# EAGLE schematic Full_Schematic (EAGLE 9.6.2)
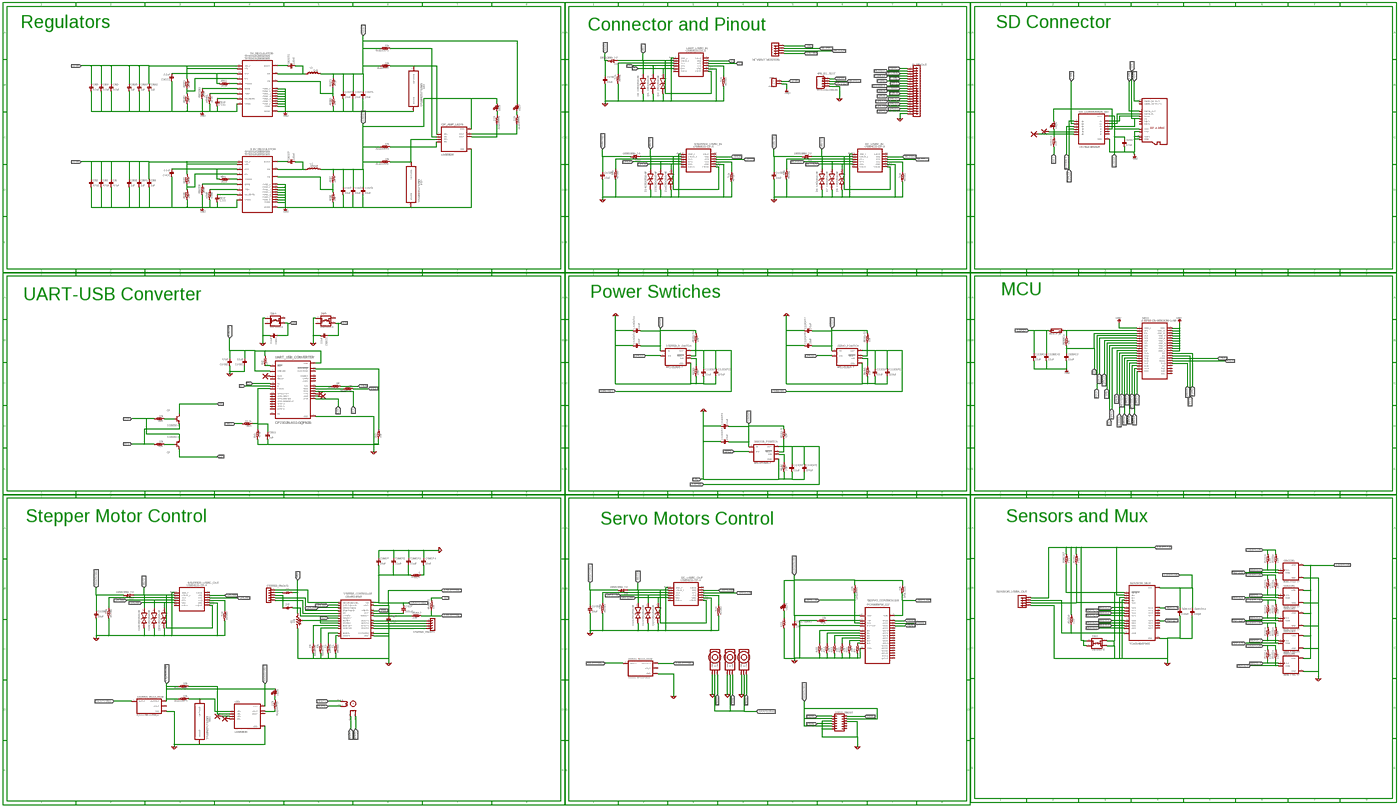
[diagram p0: schematic, sheet 1, overview]
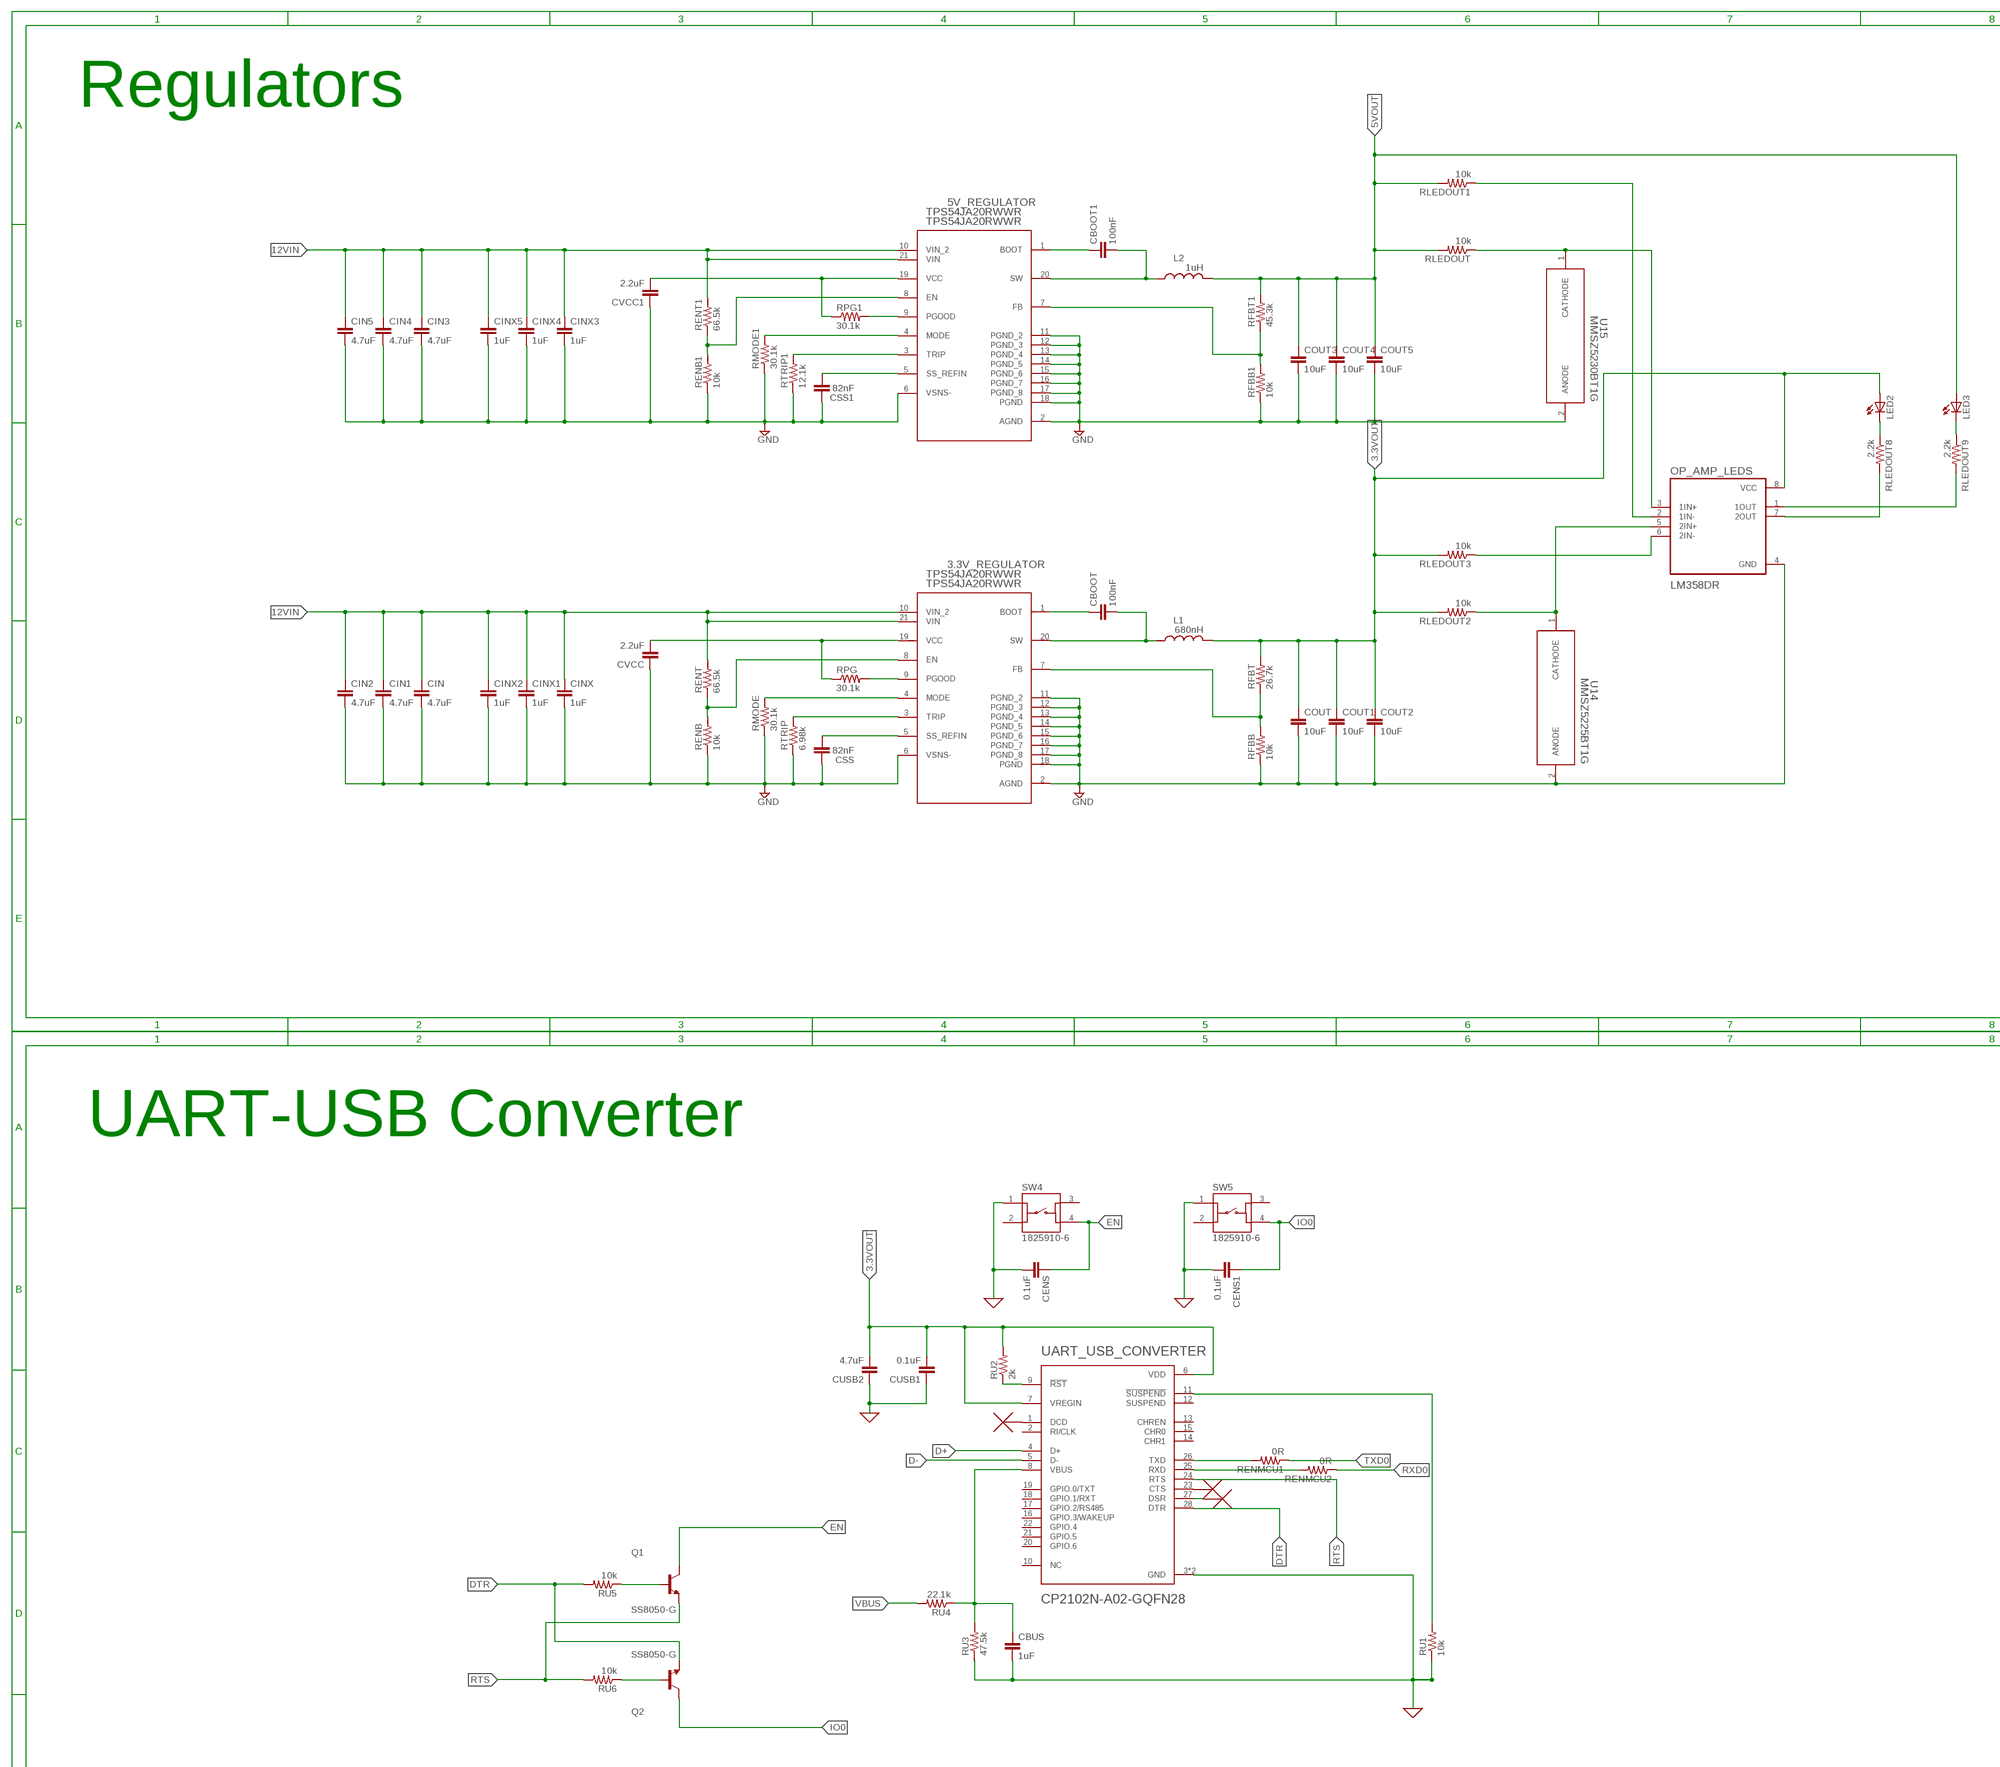
[diagram p1: schematic, sheet 1, part 1 of 8]
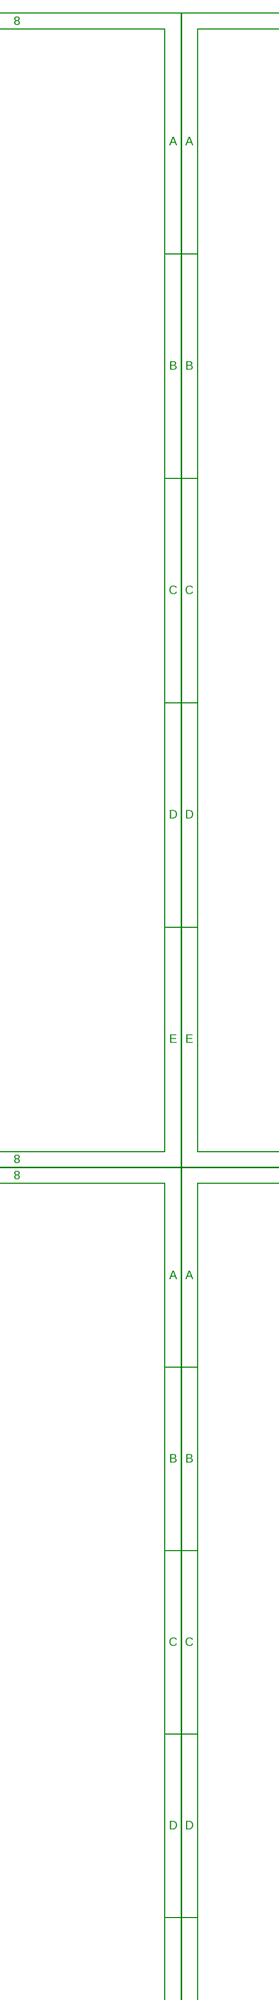
[diagram p2: schematic, sheet 1, part 2 of 8]
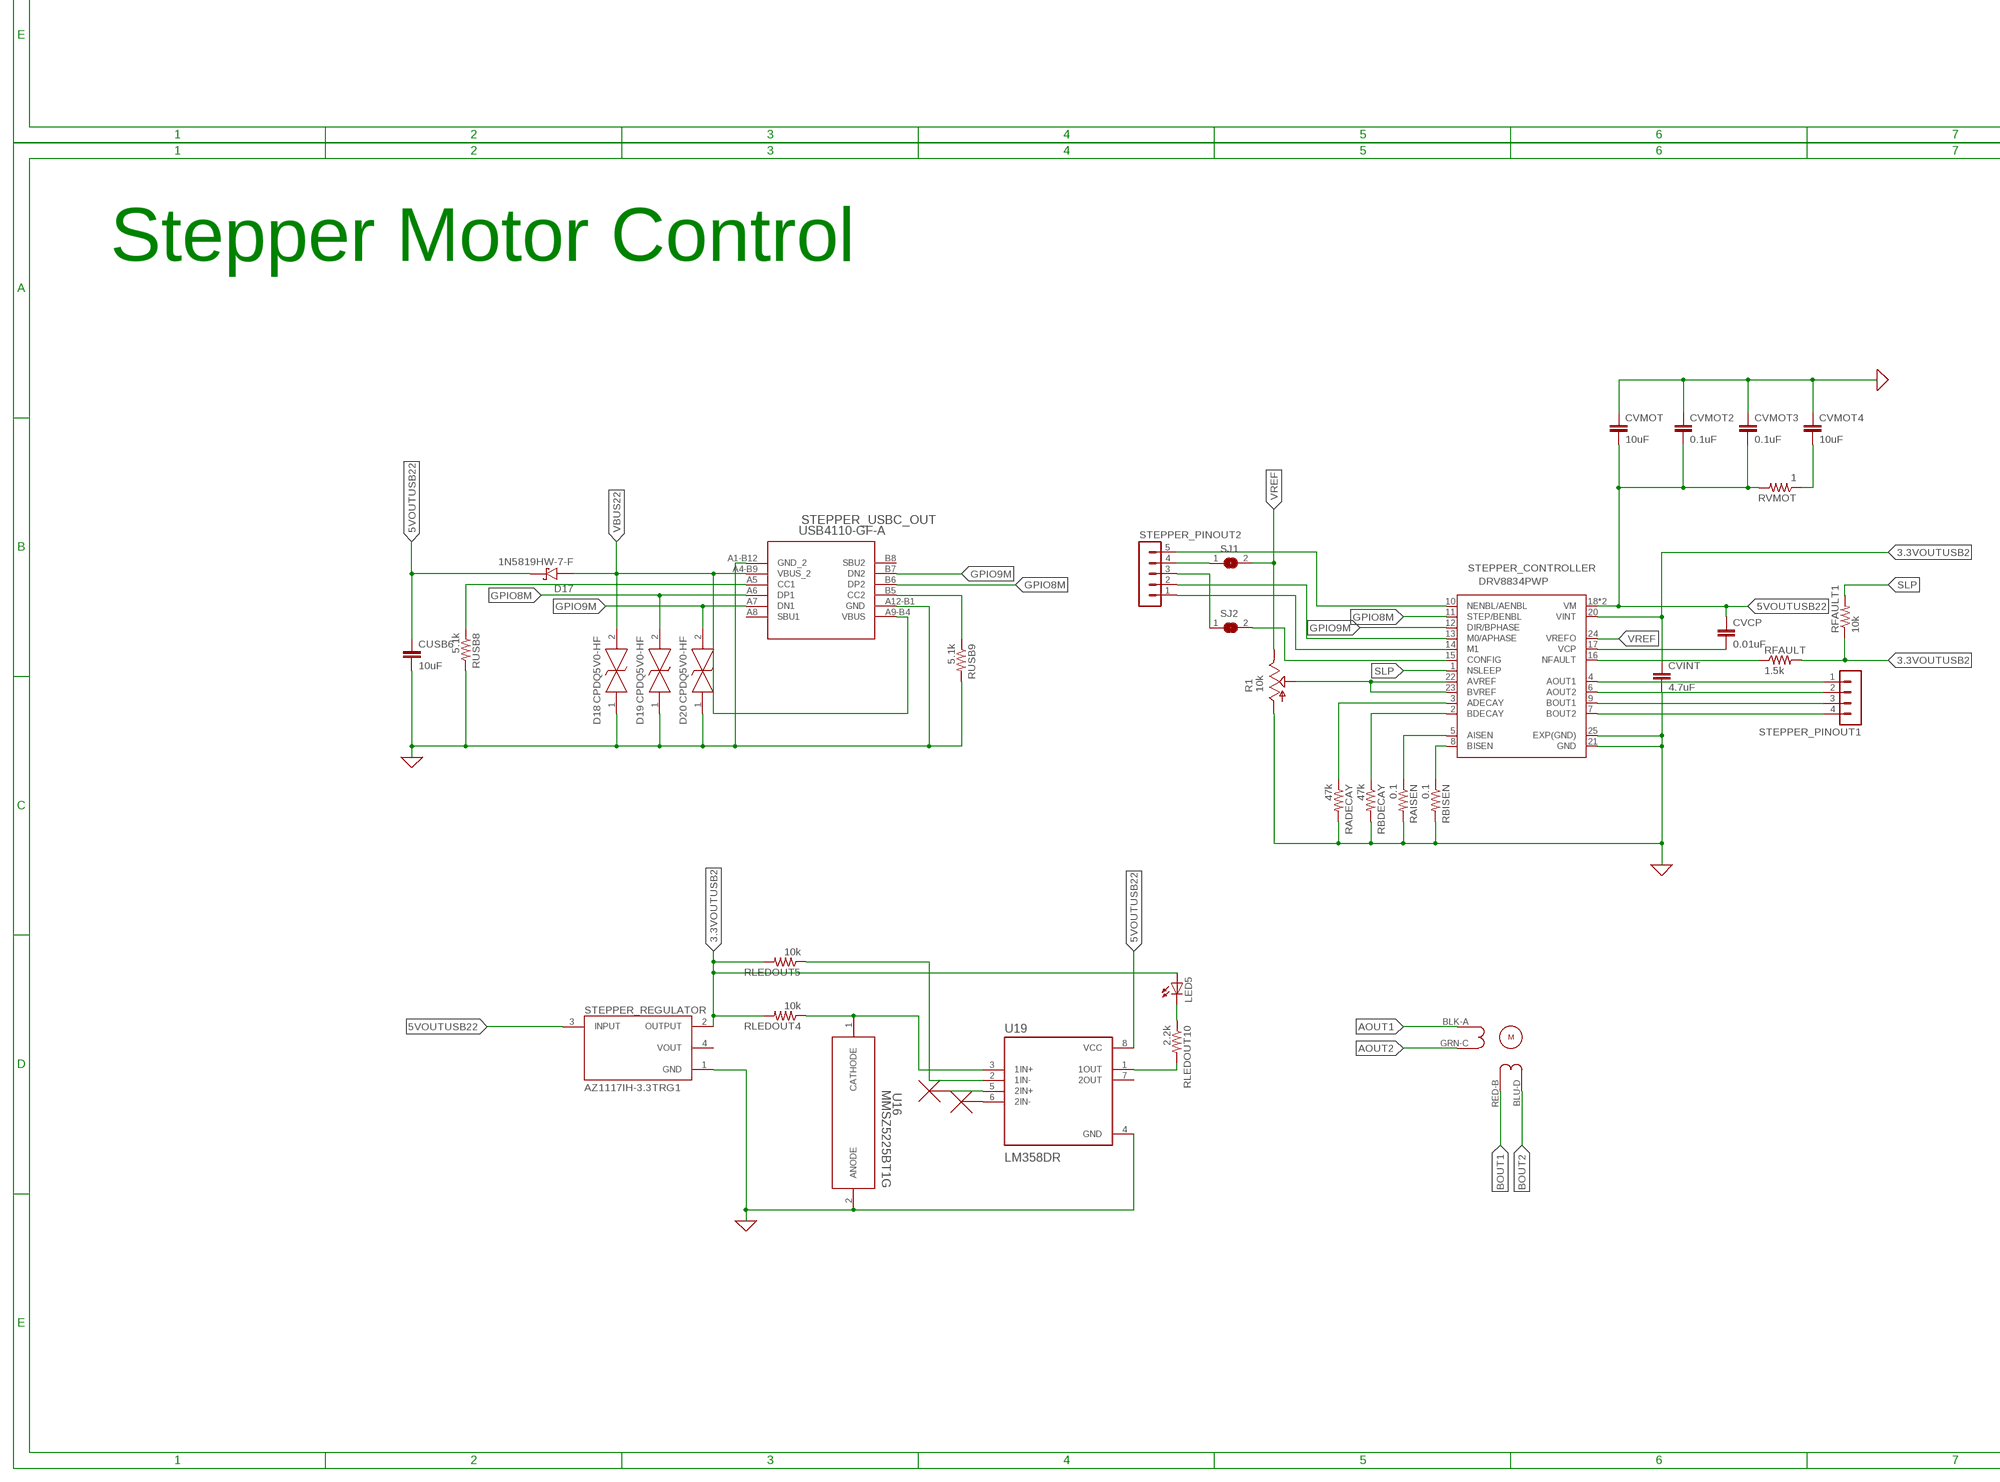
[diagram p3: schematic, sheet 1, part 3 of 8]
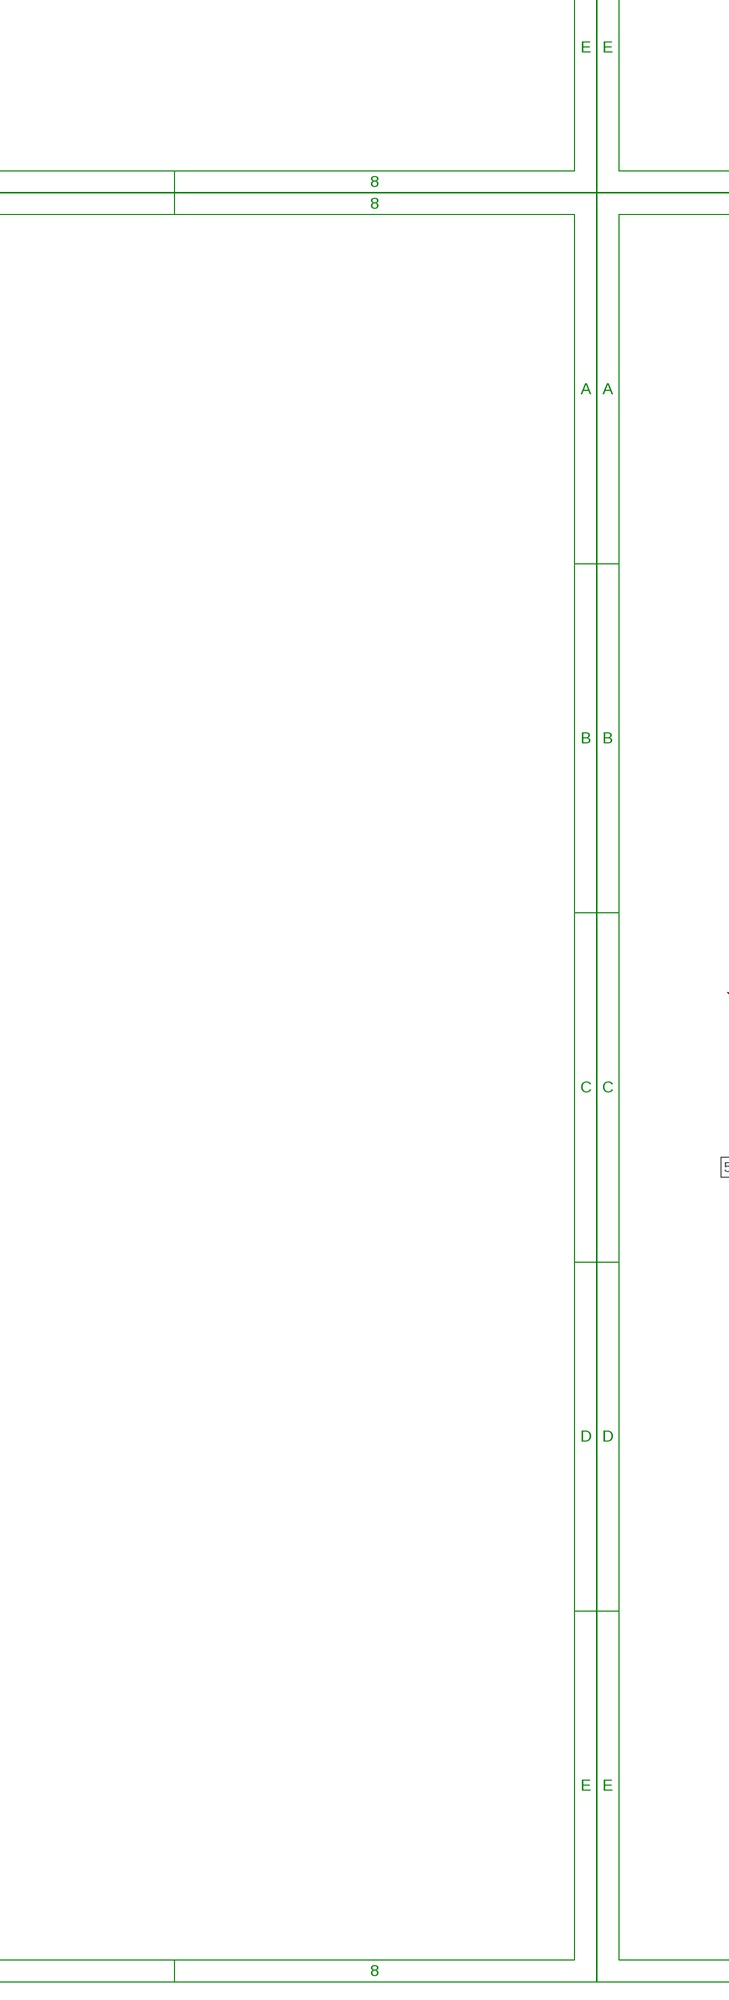
[diagram p4: schematic, sheet 1, part 4 of 8]
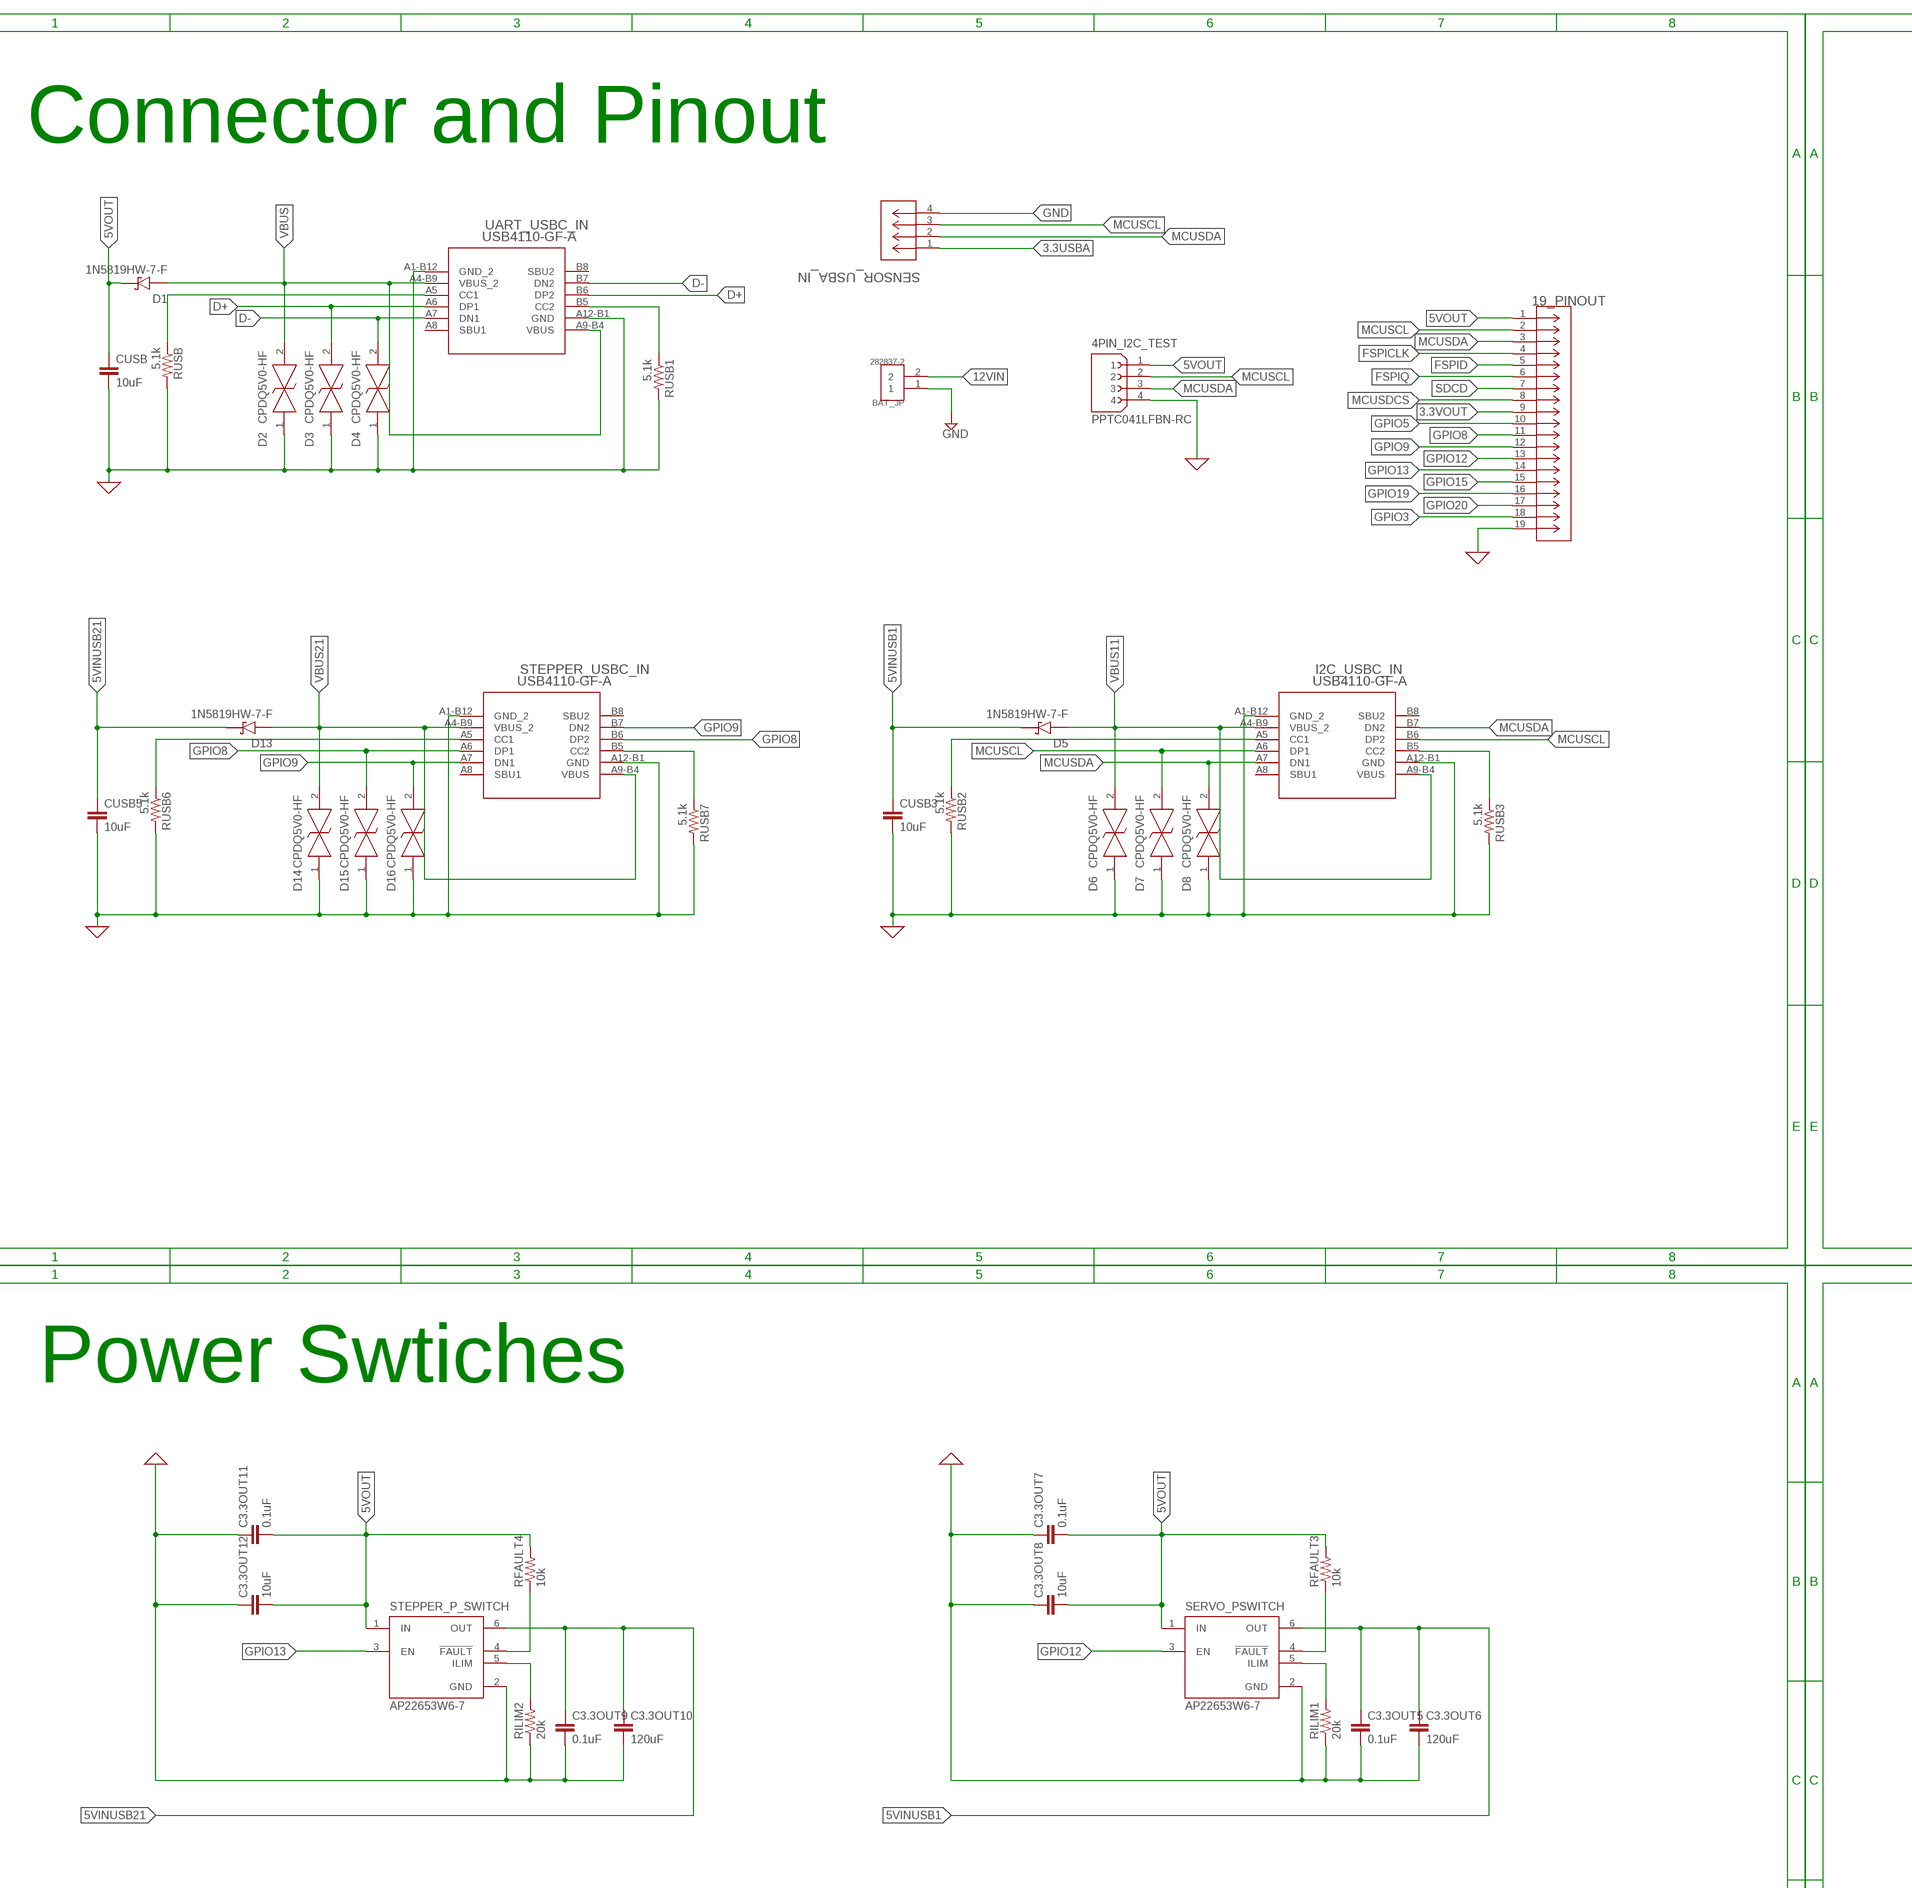
[diagram p5: schematic, sheet 1, part 5 of 8]
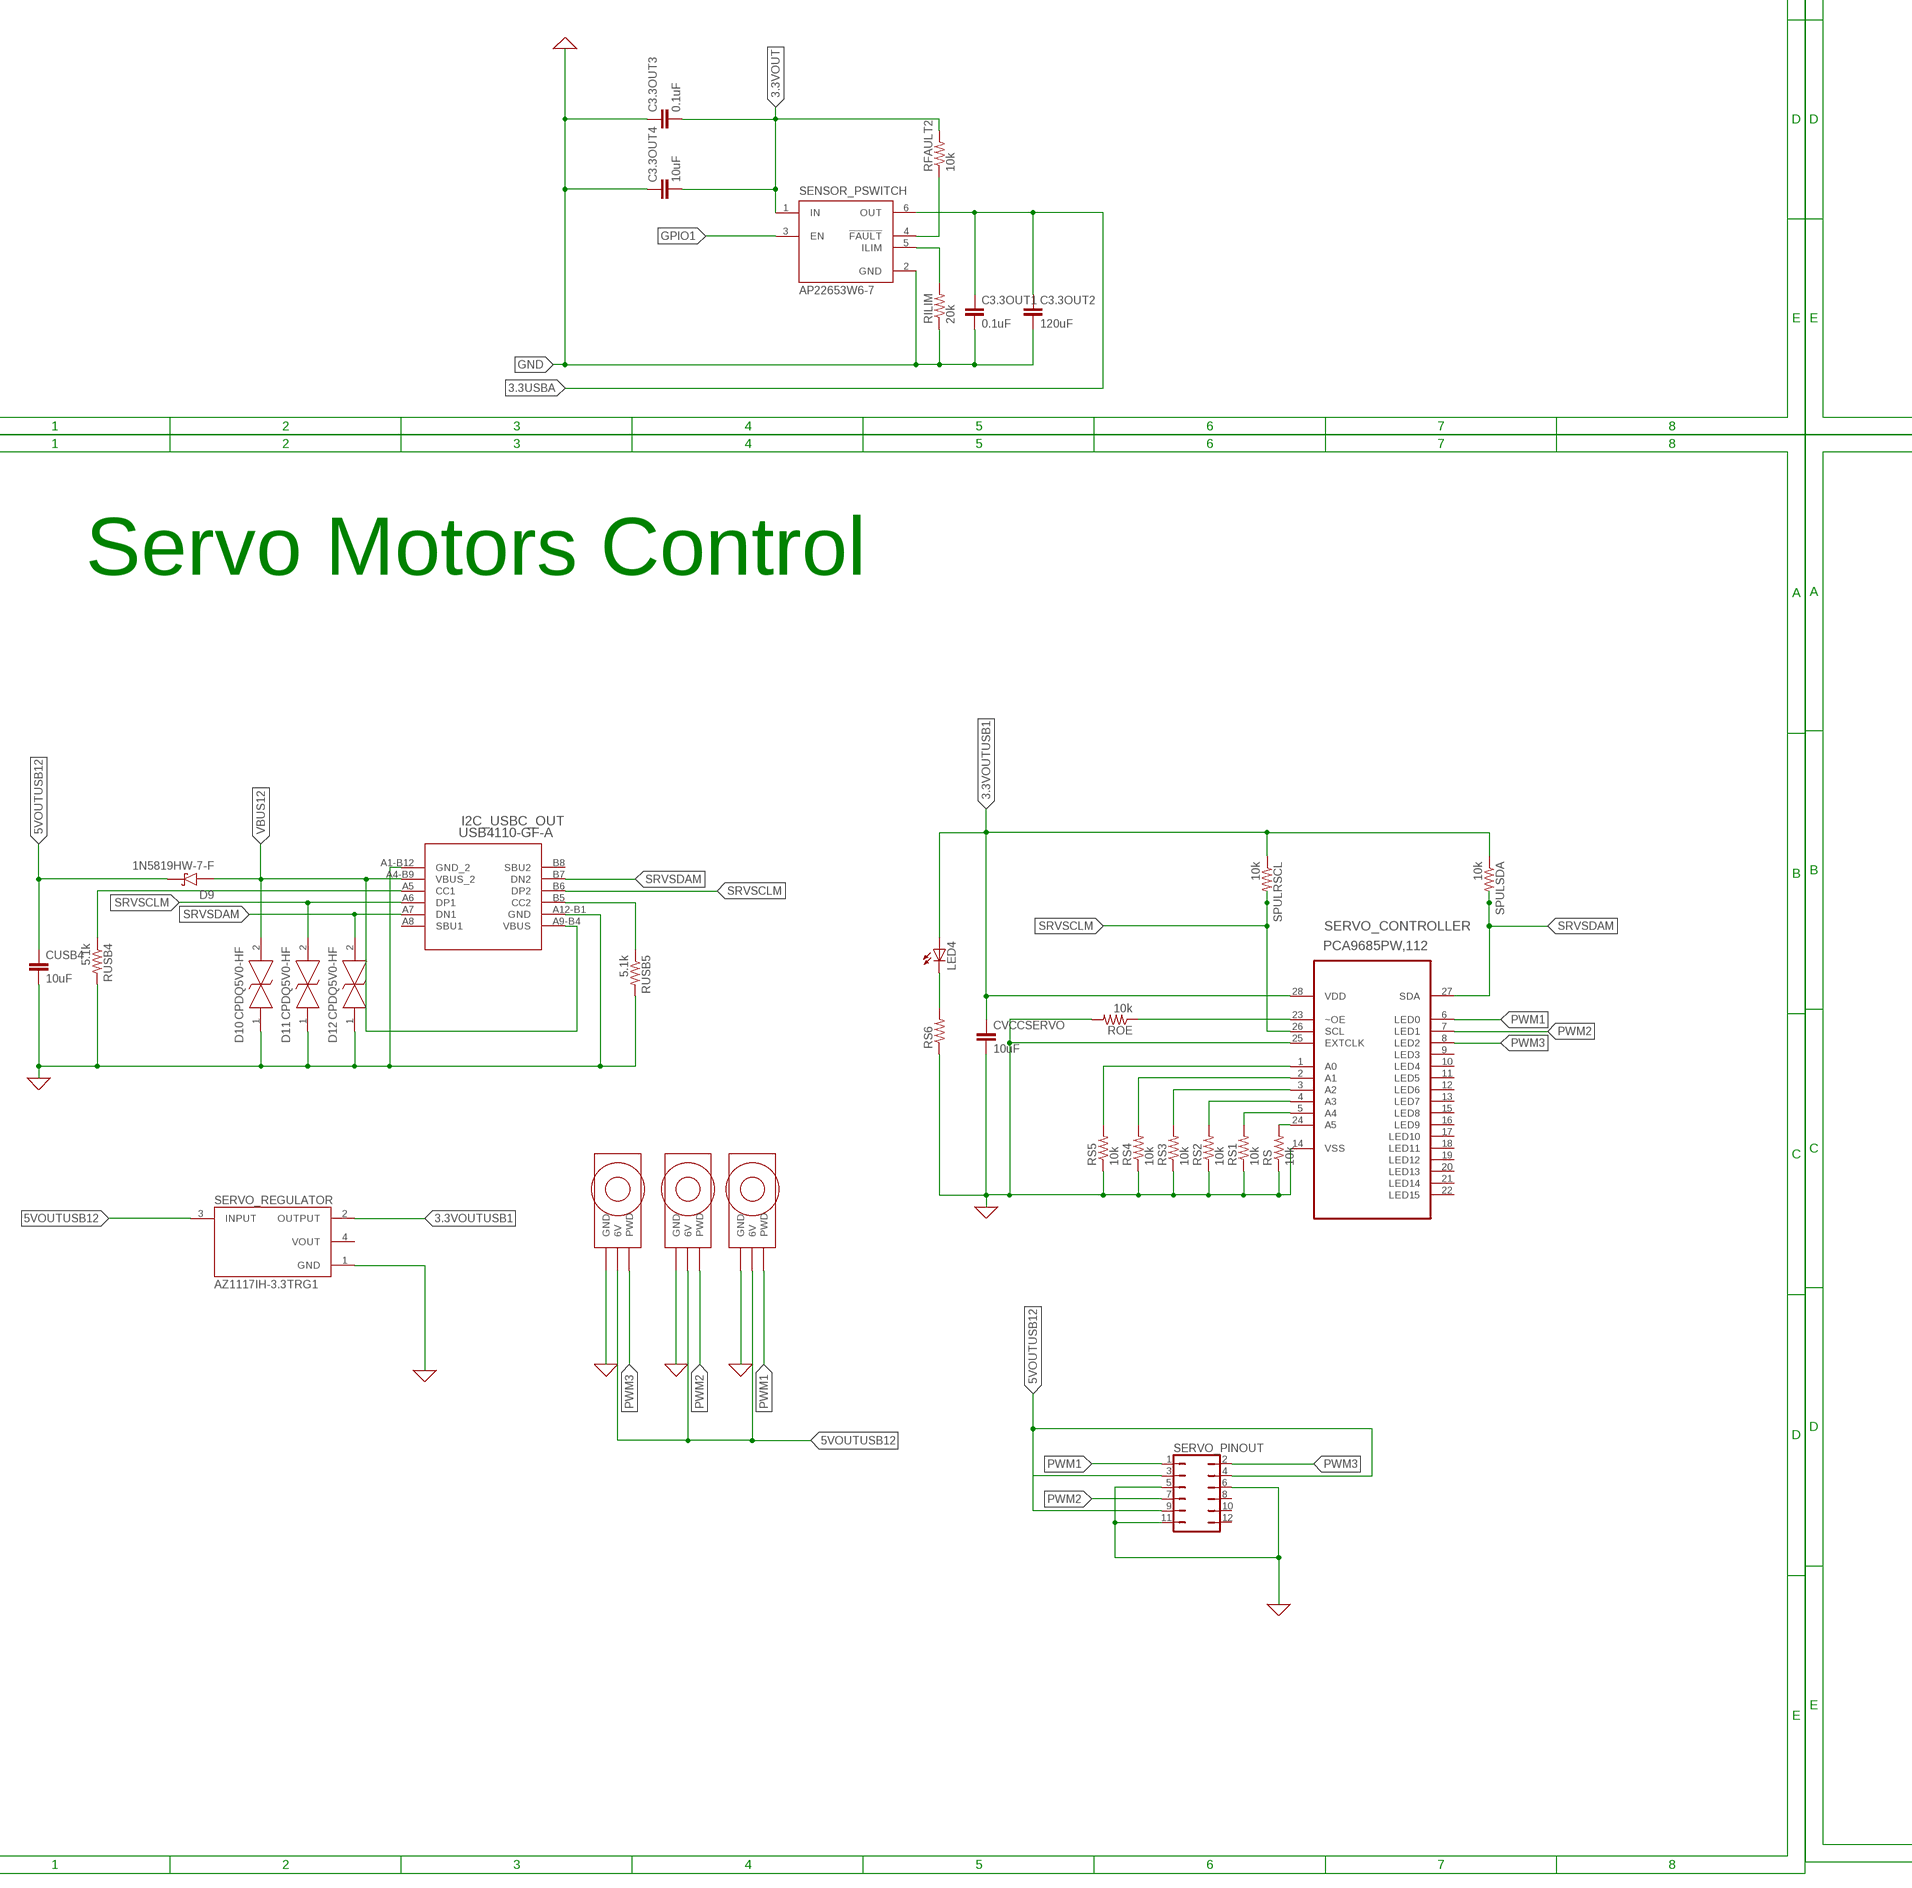
[diagram p6: schematic, sheet 1, part 6 of 8]
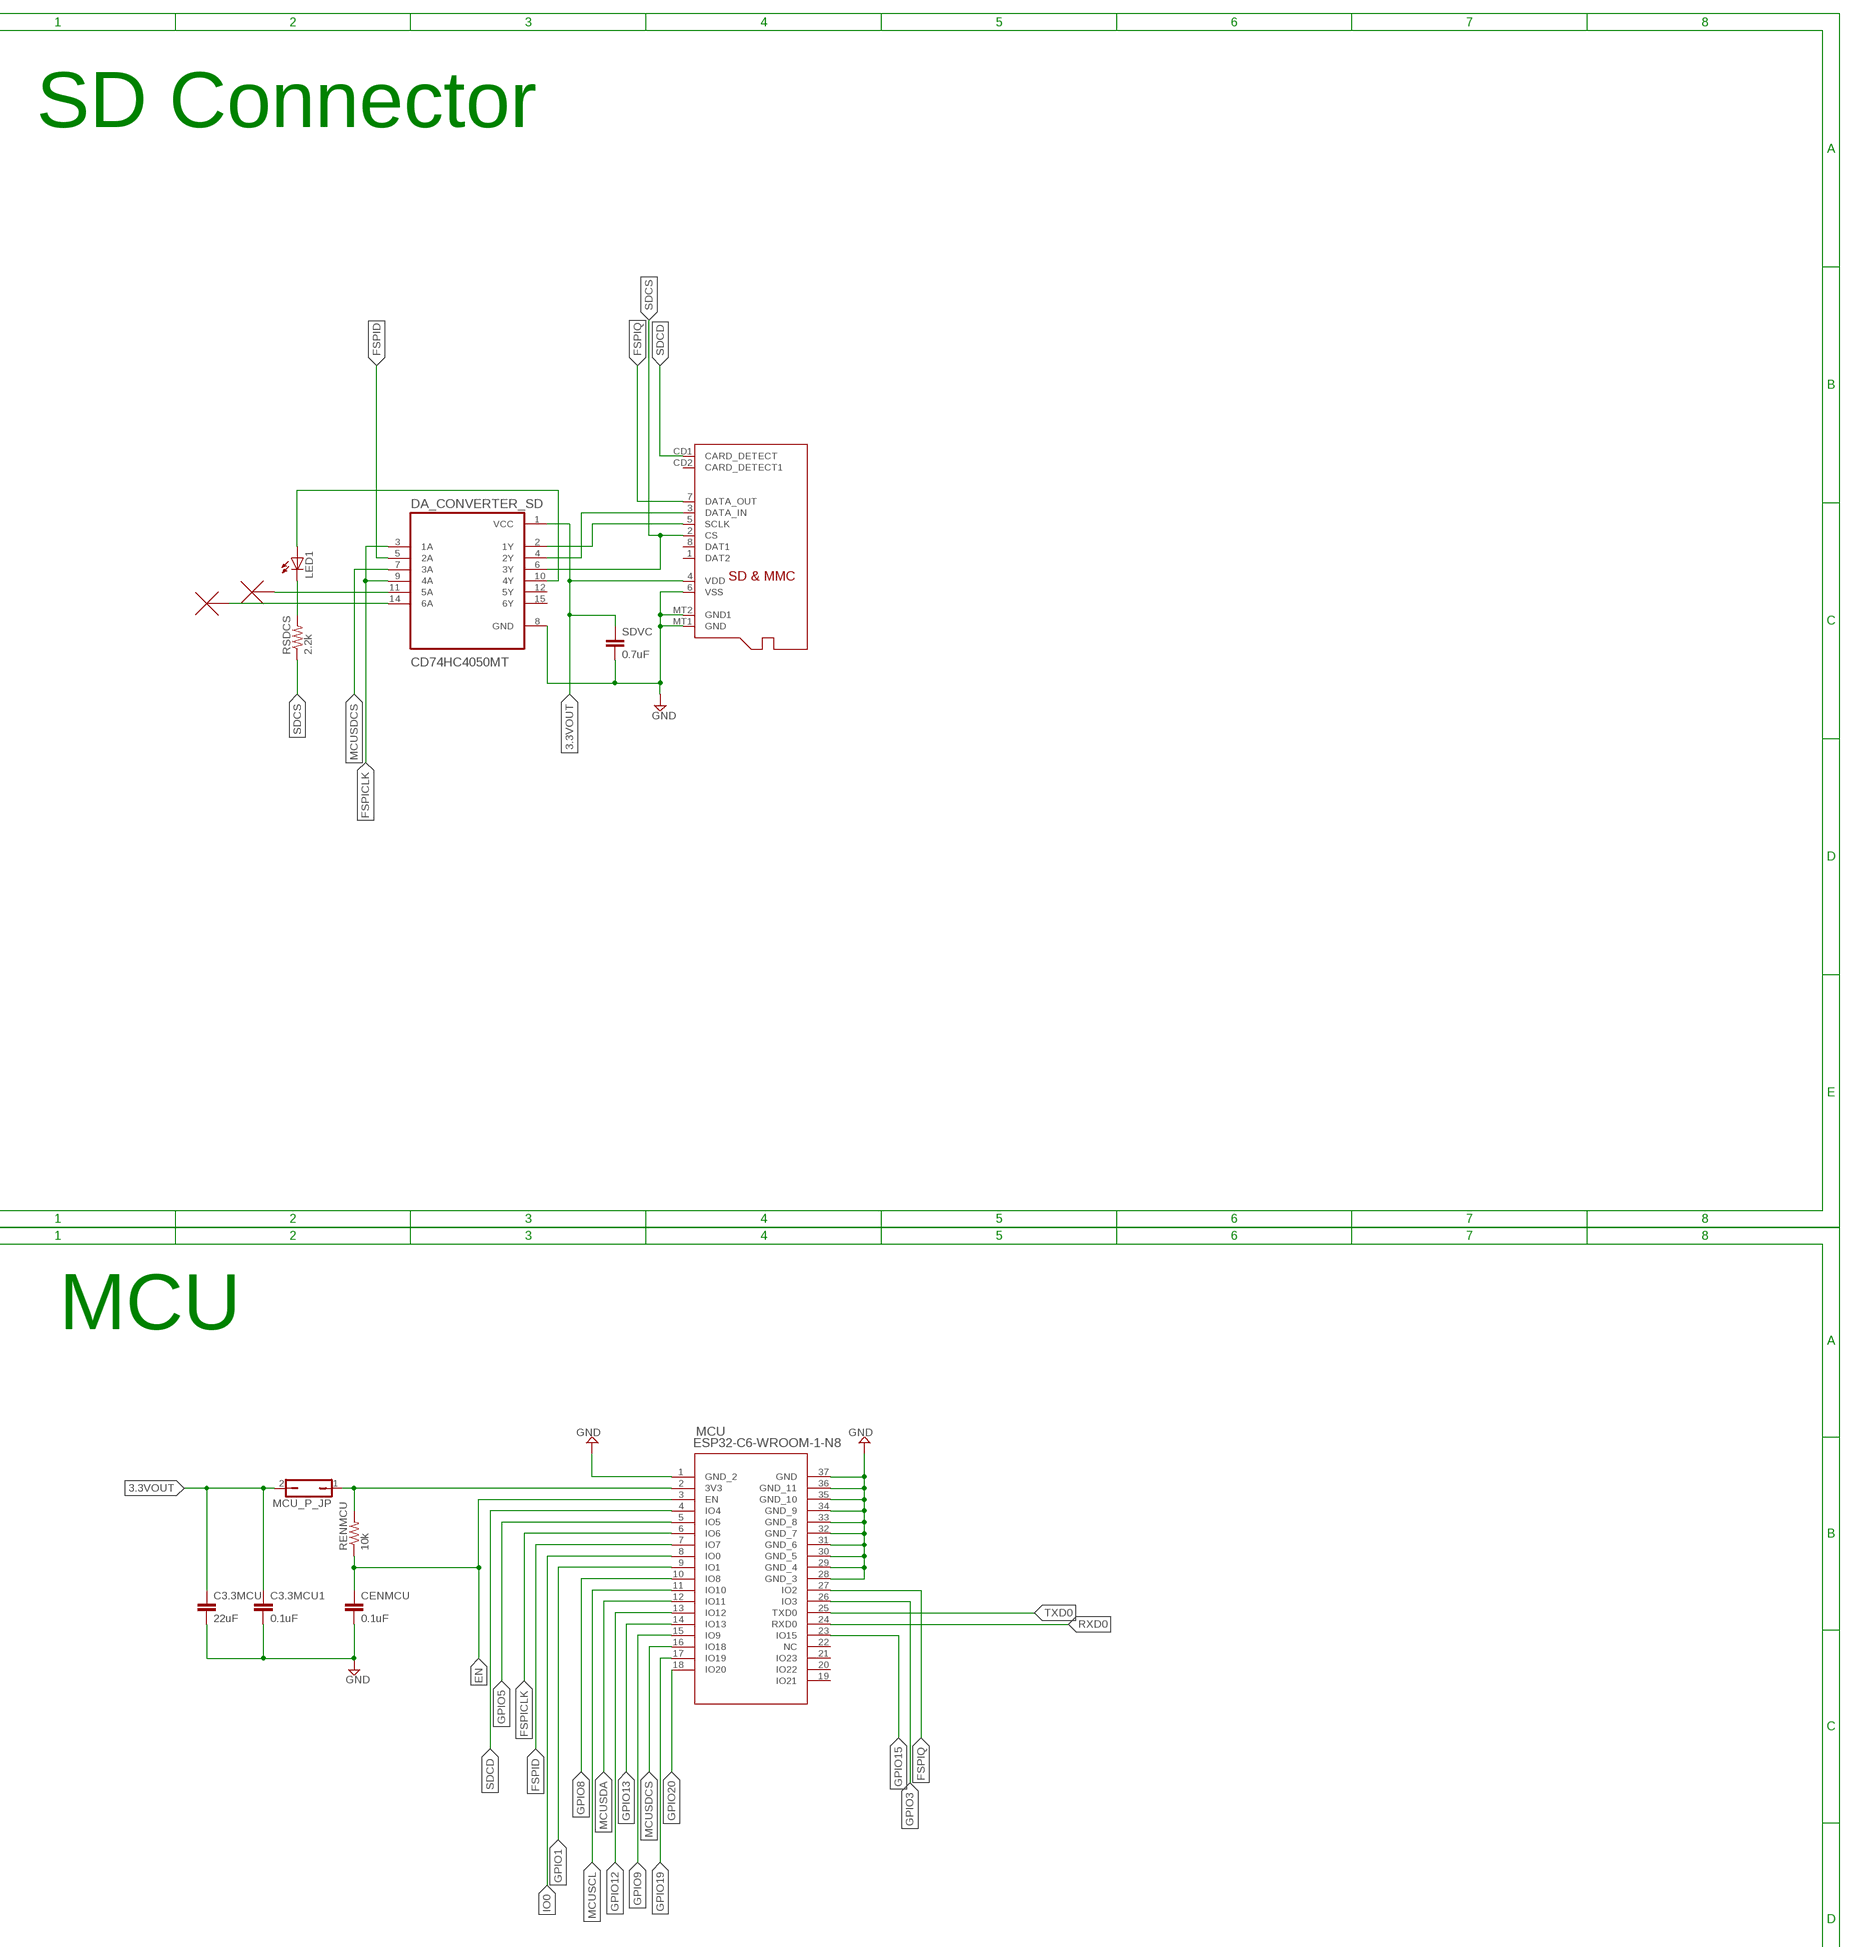
[diagram p7: schematic, sheet 1, part 7 of 8]
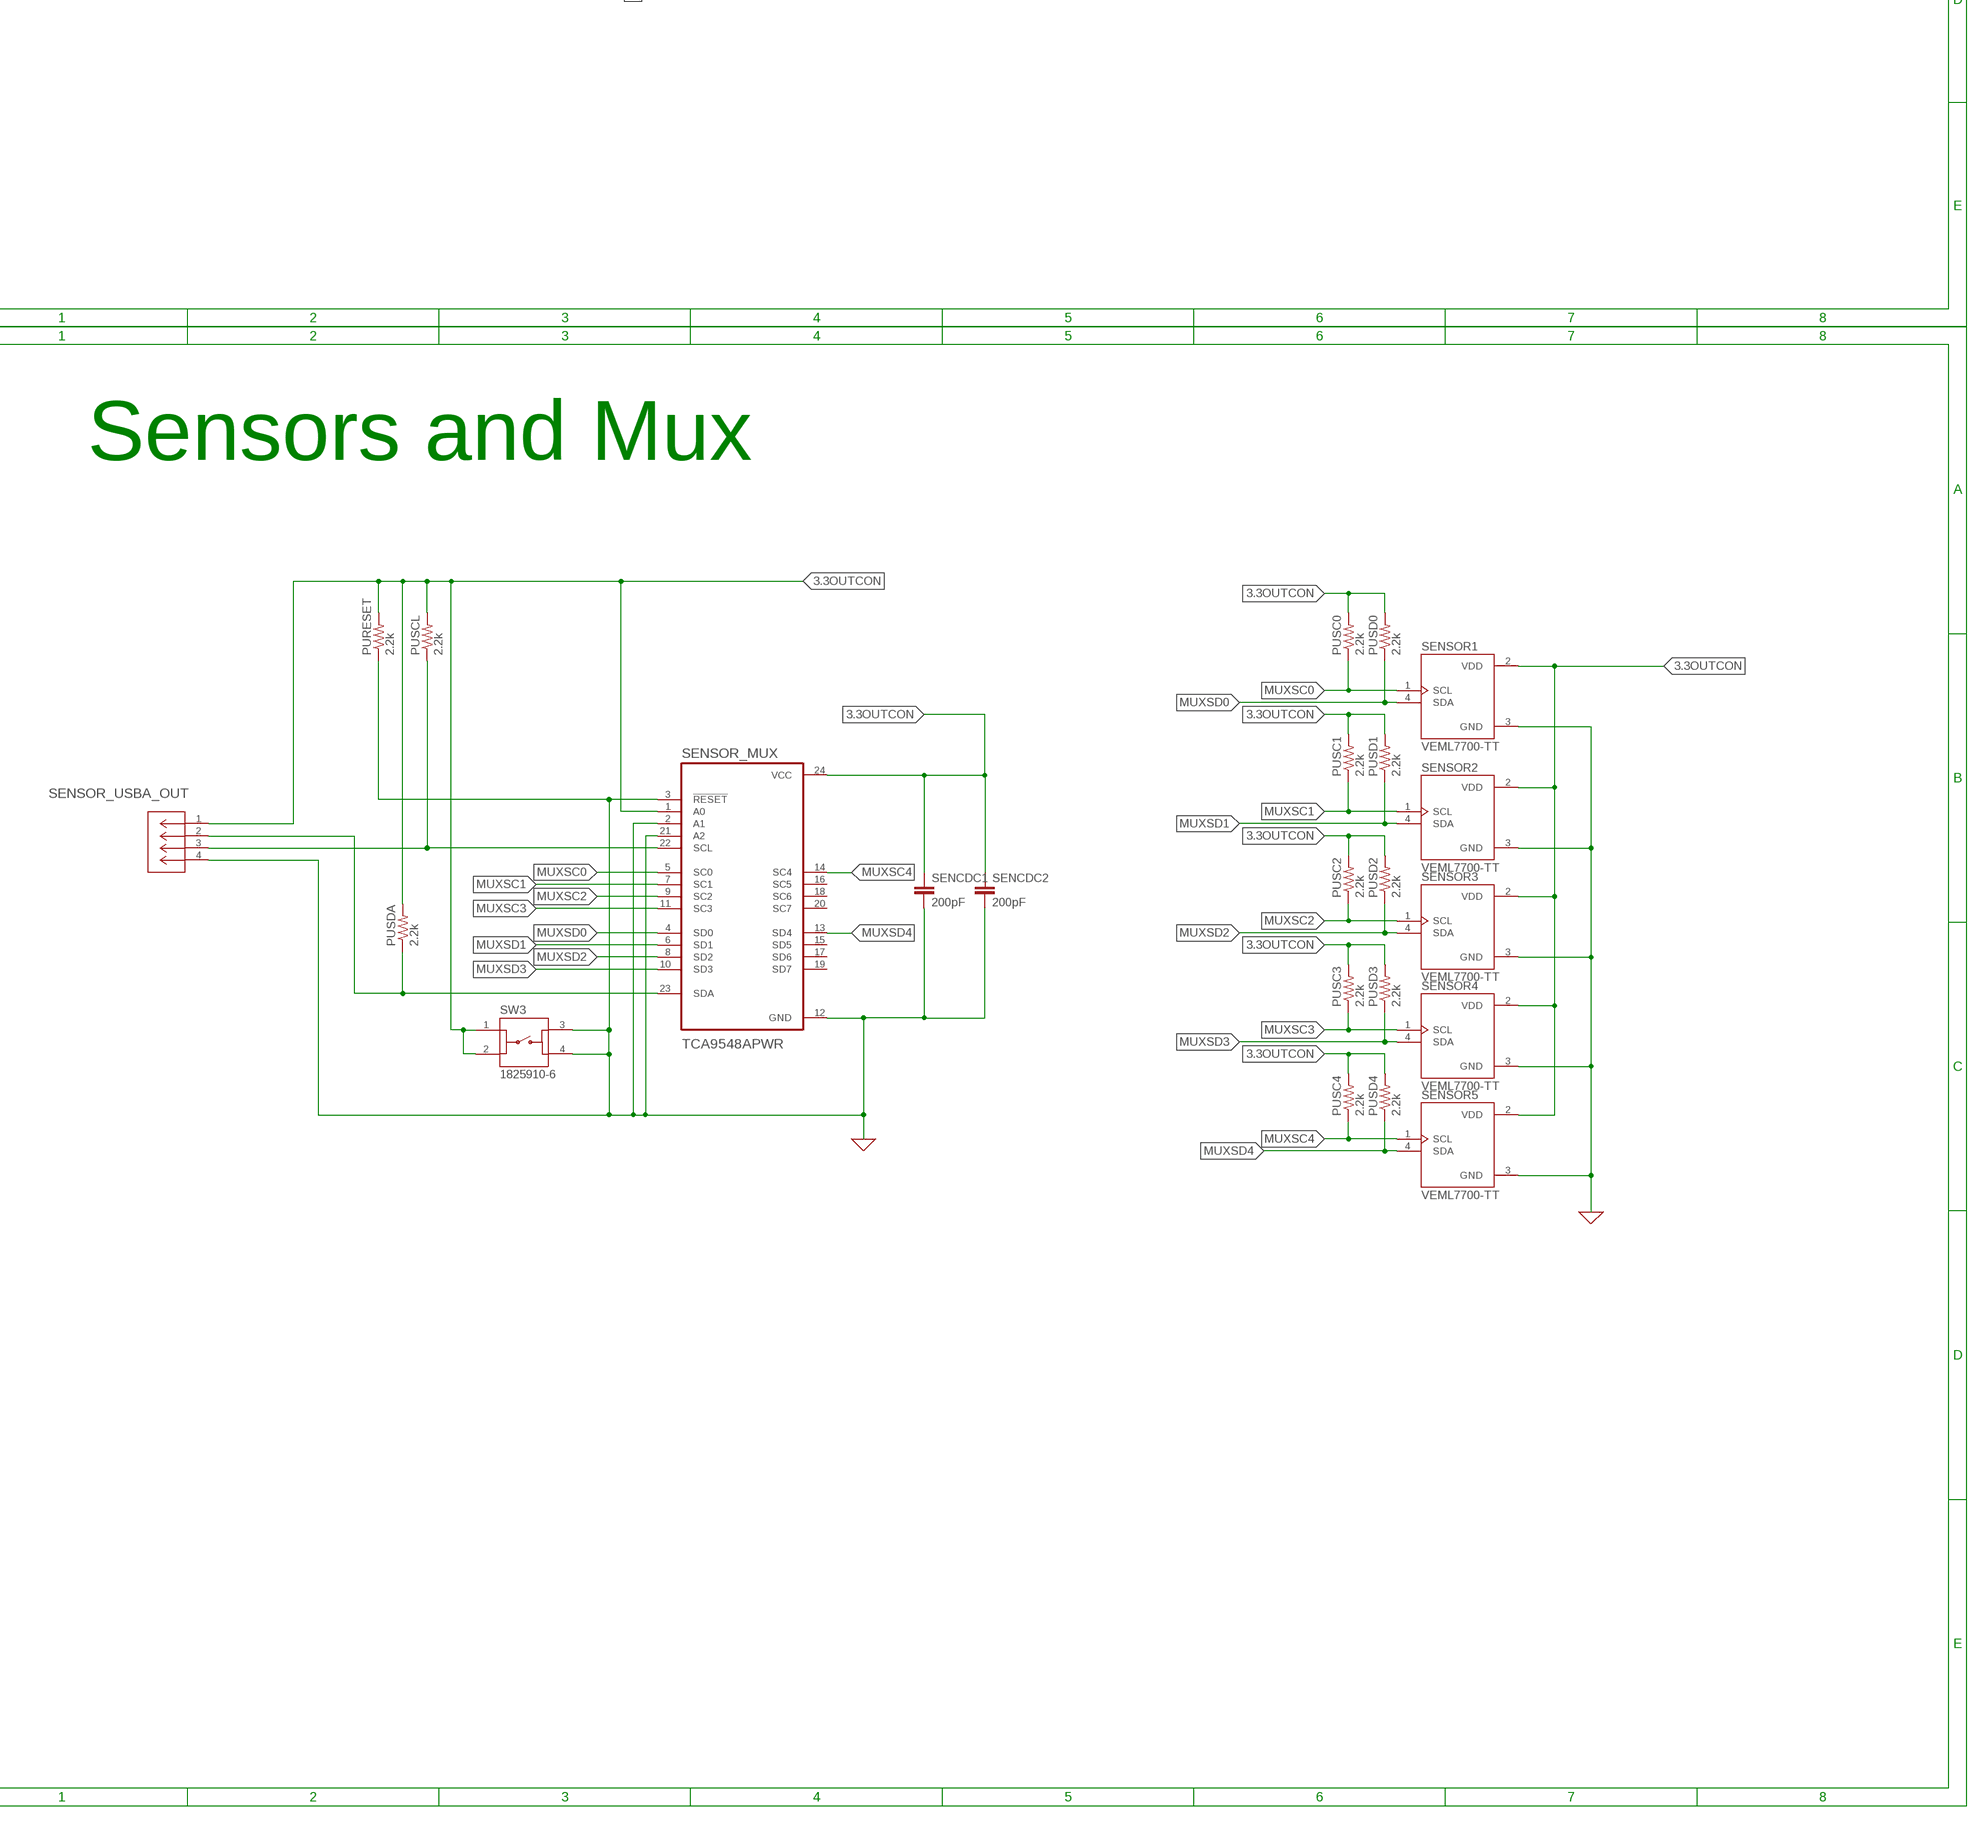
[diagram p8: schematic, sheet 1, part 8 of 8]

## Parts
3.3V_REGULATOR  TPS54JA20RWWR  [RWW0021A]
4PIN_I2C_TEST  PPTC041LFBN-RC  [SULLINS_PPTC041LFBN-RC]
5V_REGULATOR  TPS54JA20RWWR  [RWW0021A]
19_PINOUT  PPTC191LFBN-RC  [CONN19_PPTC191LFBN-RC_SUL]
BAT_JP  282837-2  [TE_282837-2]
C3.3MCU  22uF  C-EUC0805  [C0805]
C3.3MCU1  0.1uF  C-EUC0805  [C0805]
C3.3OUT1  0.1uF  C-EUC0805  [C0805]
C3.3OUT2  120uF  C-EUC0805  [C0805]
C3.3OUT3  0.1uF  C-EUC0805  [C0805]
C3.3OUT4  10uF  C-EUC0805  [C0805]
C3.3OUT5  0.1uF  C-EUC0805  [C0805]
C3.3OUT6  120uF  C-EUC0805  [C0805]
C3.3OUT7  0.1uF  C-EUC0805  [C0805]
C3.3OUT8  10uF  C-EUC0805  [C0805]
C3.3OUT9  0.1uF  C-EUC0805  [C0805]
C3.3OUT10  120uF  C-EUC0805  [C0805]
C3.3OUT11  0.1uF  C-EUC0805  [C0805]
C3.3OUT12  10uF  C-EUC0805  [C0805]
CBOOT  100nF  C-EUC0805  [C0805]
CBOOT1  100nF  C-EUC0805  [C0805]
CBUS  1uF  C-EUC0805  [C0805]
CENMCU  0.1uF  C-EUC0805  [C0805]
CENS  0.1uF  C-EUC0805  [C0805]
CENS1  0.1uF  C-EUC0805  [C0805]
CIN  4.7uF  C-EUC0805  [C0805]
CIN1  4.7uF  C-EUC0805  [C0805]
CIN2  4.7uF  C-EUC0805  [C0805]
CIN3  4.7uF  C-EUC0805  [C0805]
CIN4  4.7uF  C-EUC0805  [C0805]
CIN5  4.7uF  C-EUC0805  [C0805]
CINX  1uF  C-EUC0805  [C0805]
CINX1  1uF  C-EUC0805  [C0805]
CINX2  1uF  C-EUC0805  [C0805]
CINX3  1uF  C-EUC0805  [C0805]
CINX4  1uF  C-EUC0805  [C0805]
CINX5  1uF  C-EUC0805  [C0805]
COUT  10uF  C-EUC0805  [C0805]
COUT1  10uF  C-EUC0805  [C0805]
COUT2  10uF  C-EUC0805  [C0805]
COUT3  10uF  C-EUC0805  [C0805]
COUT4  10uF  C-EUC0805  [C0805]
COUT5  10uF  C-EUC0805  [C0805]
CSS  82nF  C-EUC0805  [C0805]
CSS1  82nF  C-EUC0805  [C0805]
CUSB  10uF  C-EUC0805  [C0805]
CUSB1  0.1uF  C-EUC0805  [C0805]
CUSB2  4.7uF  C-EUC0805  [C0805]
CUSB3  10uF  C-EUC0805  [C0805]
CUSB4  10uF  C-EUC0805  [C0805]
CUSB5  10uF  C-EUC0805  [C0805]
CUSB6  10uF  C-EUC0805  [C0805]
CVCC  2.2uF  C-EUC0805  [C0805]
CVCC1  2.2uF  C-EUC0805  [C0805]
CVCCSERVO  10uF  C-EUC0805  [C0805]
CVCP  0.01uF  C-EUC0805  [C0805]
CVINT  4.7uF  C-EUC0805  [C0805]
CVMOT  10uF  C-EUC0805  [C0805]
CVMOT2  0.1uF  C-EUC0805  [C0805]
CVMOT3  0.1uF  C-EUC0805  [C0805]
CVMOT4  10uF  C-EUC0805  [C0805]
D1  1N5819HW-7-F  [SOD3715X145N]
D2  CPDQ5V0-HF  [MBTB-D-SOD-923F-IMP-0402]
D3  CPDQ5V0-HF  [MBTB-D-SOD-923F-IMP-0402]
D4  CPDQ5V0-HF  [MBTB-D-SOD-923F-IMP-0402]
D5  1N5819HW-7-F  [SOD3715X145N]
D6  CPDQ5V0-HF  [MBTB-D-SOD-923F-IMP-0402]
D7  CPDQ5V0-HF  [MBTB-D-SOD-923F-IMP-0402]
D8  CPDQ5V0-HF  [MBTB-D-SOD-923F-IMP-0402]
D9  1N5819HW-7-F  [SOD3715X145N]
D10  CPDQ5V0-HF  [MBTB-D-SOD-923F-IMP-0402]
D11  CPDQ5V0-HF  [MBTB-D-SOD-923F-IMP-0402]
D12  CPDQ5V0-HF  [MBTB-D-SOD-923F-IMP-0402]
D13  1N5819HW-7-F  [SOD3715X145N]
D14  CPDQ5V0-HF  [MBTB-D-SOD-923F-IMP-0402]
D15  CPDQ5V0-HF  [MBTB-D-SOD-923F-IMP-0402]
D16  CPDQ5V0-HF  [MBTB-D-SOD-923F-IMP-0402]
D17  1N5819HW-7-F  [SOD3715X145N]
D18  CPDQ5V0-HF  [MBTB-D-SOD-923F-IMP-0402]
D19  CPDQ5V0-HF  [MBTB-D-SOD-923F-IMP-0402]
D20  CPDQ5V0-HF  [MBTB-D-SOD-923F-IMP-0402]
DA_CONVERTER_SD  CD74HC4050MT  [SOIC127P600X175-16N]
I2C_USBC_IN  USB4110-GF-A  [USB4110-GF-A_GCT]
I2C_USBC_OUT  USB4110-GF-A  [USB4110-GF-A_GCT]
L1  680nH  L-US6000-XXX-RC  [6000-XXXX-RC]
L2  1uH  L-US6000-XXX-RC  [6000-XXXX-RC]
LED1  LED  [SMARTLED-TTW]
LED2  LED  [SMARTLED-TTW]
LED3  LED  [SMARTLED-TTW]
LED4  LED  [SMARTLED-TTW]
LED5  LED  [SMARTLED-TTW]
MCU  ESP32-C6-WROOM-1-N8  [MOD28_ESP32-C6-WROOM-1_EXP]
MCU_P_JP  JP1Q  [JP1]
OP_AMP_LEDS  LM358DR  [SOIC127P599X175-8N]
PURESET  2.2k  R-US_M0805  [M0805]
PUSC0  2.2k  R-US_M0805  [M0805]
PUSC1  2.2k  R-US_M0805  [M0805]
PUSC2  2.2k  R-US_M0805  [M0805]
PUSC3  2.2k  R-US_M0805  [M0805]
PUSC4  2.2k  R-US_M0805  [M0805]
PUSCL  2.2k  R-US_M0805  [M0805]
PUSD0  2.2k  R-US_M0805  [M0805]
PUSD1  2.2k  R-US_M0805  [M0805]
PUSD2  2.2k  R-US_M0805  [M0805]
PUSD3  2.2k  R-US_M0805  [M0805]
PUSD4  2.2k  R-US_M0805  [M0805]
PUSDA  2.2k  R-US_M0805  [M0805]
Q1  SS8050-G  [TRANS_SS8050-G]
Q2  SS8050-G  [TRANS_SS8050-G]
R1  10k  TRIM_US-3223G  [3223G]
RADECAY  47k  R-US_M0805  [M0805]
RAISEN  0.1  R-US_M0805  [M0805]
RBDECAY  47k  R-US_M0805  [M0805]
RBISEN  0.1  R-US_M0805  [M0805]
RENB  10k  R-US_M0805  [M0805]
RENB1  10k  R-US_M0805  [M0805]
RENMCU  10k  R-US_M0805  [M0805]
RENMCU1  0R  R-US_M0805  [M0805]
RENMCU2  0R  R-US_M0805  [M0805]
RENT  66.5k  R-US_M0805  [M0805]
RENT1  66.5k  R-US_M0805  [M0805]
RFAULT  1.5k  R-US_M0805  [M0805]
RFAULT1  10k  R-US_M0805  [M0805]
RFAULT2  10k  R-US_M0805  [M0805]
RFAULT3  10k  R-US_M0805  [M0805]
RFAULT4  10k  R-US_M0805  [M0805]
RFBB  10k  R-US_M0805  [M0805]
RFBB1  10k  R-US_M0805  [M0805]
RFBT  26.7k  R-US_M0805  [M0805]
RFBT1  45.3k  R-US_M0805  [M0805]
RILIM  20k  R-US_M0805  [M0805]
RILIM1  20k  R-US_M0805  [M0805]
RILIM2  20k  R-US_M0805  [M0805]
RLEDOUT  10k  R-US_M0805  [M0805]
RLEDOUT1  10k  R-US_M0805  [M0805]
RLEDOUT2  10k  R-US_M0805  [M0805]
RLEDOUT3  10k  R-US_M0805  [M0805]
RLEDOUT4  10k  R-US_M0805  [M0805]
RLEDOUT5  10k  R-US_M0805  [M0805]
RLEDOUT8  2.2k  R-US_M0805  [M0805]
RLEDOUT9  2.2k  R-US_M0805  [M0805]
RLEDOUT10  2.2k  R-US_M0805  [M0805]
RMODE  30.1k  R-US_M0805  [M0805]
RMODE1  30.1k  R-US_M0805  [M0805]
ROE  10k  R-US_M0805  [M0805]
RPG  30.1k  R-US_M0805  [M0805]
RPG1  30.1k  R-US_M0805  [M0805]
RS  10k  R-US_R0805  [R0805]
RS1  10k  R-US_R0805  [R0805]
RS2  10k  R-US_R0805  [R0805]
RS3  10k  R-US_R0805  [R0805]
RS4  10k  R-US_R0805  [R0805]
RS5  10k  R-US_R0805  [R0805]
RS6  2.2k  R-US_R0805  [R0805]
RSDCS  2.2k  R-US_M0805  [M0805]
RTRIP  6.98k  R-US_M0805  [M0805]
RTRIP1  12.1k  R-US_M0805  [M0805]
RU1  10k  R-US_M0805  [M0805]
RU2  2k  R-US_M0805  [M0805]
RU3  47.5k  R-US_M0805  [M0805]
RU4  22.1k  R-US_M0805  [M0805]
RU5  10k  R-US_M0805  [M0805]
RU6  10k  R-US_M0805  [M0805]
RUSB  5.1k  R-US_M0805  [M0805]
RUSB1  5.1k  R-US_M0805  [M0805]
RUSB2  5.1k  R-US_M0805  [M0805]
RUSB3  5.1k  R-US_M0805  [M0805]
RUSB4  5.1k  R-US_M0805  [M0805]
RUSB5  5.1k  R-US_M0805  [M0805]
RUSB6  5.1k  R-US_M0805  [M0805]
RUSB7  5.1k  R-US_M0805  [M0805]
RUSB8  5.1k  R-US_M0805  [M0805]
RUSB9  5.1k  R-US_M0805  [M0805]
RVMOT  1  R-US_M0805  [M0805]
SD_CONNECTOR  MICROSD  [MICROSD]
SDVC  0.7uF  C-EUC0805  [C0805]
SENCDC1  200pF  C-EUC0805  [C0805]
SENCDC2  200pF  C-EUC0805  [C0805]
SENSOR1  VEML7700-TT  [XDCR_VEML7700-TT]
SENSOR2  VEML7700-TT  [XDCR_VEML7700-TT]
SENSOR3  VEML7700-TT  [XDCR_VEML7700-TT]
SENSOR4  VEML7700-TT  [XDCR_VEML7700-TT]
SENSOR5  VEML7700-TT  [XDCR_VEML7700-TT]
SENSOR_MUX  TCA9548APWR  [SOP65P640X120-24N]
SENSOR_PSWITCH  AP22653W6-7  [SOT95P280X145-6N]
SENSOR_USBA_IN  USB-AP-S-RA-SMT  [CONN_USB-AP-S-RA-SMT_ADM]
SENSOR_USBA_OUT  USB-AP-S-RA-SMT  [CONN_USB-AP-S-RA-SMT_ADM]
SERVO_CONTROLLER  PCA9685PW,112  [SOP65P640X110-28N]
SERVO_PINOUT  JP6Q  [JP6Q]
SERVO_PSWITCH  AP22653W6-7  [SOT95P280X145-6N]
SERVO_REGULATOR  AZ1117IH-3.3TRG1  [SOT230P700X185-4N]
SJ1  SJ  [SJ]
SJ2  SJ  [SJ]
SPULRSCL  10k  R-US_M0805  [M0805]
SPULSDA  10k  R-US_M0805  [M0805]
STEPPER_CONTROLLER  DRV8834PWP  [SOP65P640X120-25N]
STEPPER_P_SWITCH  AP22653W6-7  [SOT95P280X145-6N]
STEPPER_PINOUT1  MA04-1  [MA04-1]
STEPPER_PINOUT2  MA05-1  [MA05-1]
STEPPER_REGULATOR  AZ1117IH-3.3TRG1  [SOT230P700X185-4N]
STEPPER_USBC_IN  USB4110-GF-A  [USB4110-GF-A_GCT]
STEPPER_USBC_OUT  USB4110-GF-A  [USB4110-GF-A_GCT]
SW3  1825910-6  [SW_1825910-6-4]
SW4  1825910-6  [SW_1825910-6-4]
SW5  1825910-6  [SW_1825910-6-4]
U14  MMSZ5225BT1G  [SOD-123_ONS]
U15  MMSZ5230BT1G  [SOD-123_ONS]
U16  MMSZ5225BT1G  [SOD-123_ONS]
U19  LM358DR  [SOIC127P599X175-8N]
U$1  NEMA23  [NEMA23]
U$2  NC_MARKER  (no package)
U$3  SERVO  [SERVO]
U$4  SERVO  [SERVO]
U$5  SERVO  [SERVO]
U$6  NC_MARKER  (no package)
U$7  NC_MARKER  (no package)
U$8  NC_MARKER  (no package)
U$9  NC_MARKER  (no package)
U$10  NC_MARKER  (no package)
U$11  NC_MARKER  (no package)
UART_USB_CONVERTER  CP2102N-A02-GQFN28  [QFN50P500X500X80-29N]
UART_USBC_IN  USB4110-GF-A  [USB4110-GF-A_GCT]

## Nets
3.3OUTCON: PURESET.2 PUSC0.2 PUSC1.2 PUSC2.2 PUSC3.2 PUSC4.2 PUSCL.2 PUSD0.2 PUSD1.2 PUSD2.2 PUSD3.2 PUSD4.2 PUSDA.2 SENCDC1.1 SENCDC2.1 SENSOR1.2(VDD) SENSOR2.2(VDD) SENSOR3.2(VDD) SENSOR4.2(VDD) SENSOR5.2(VDD) SENSOR_MUX.1(A0) SENSOR_MUX.24(VCC) SENSOR_USBA_OUT.1 SW3.1 SW3.2
3.3USBA: C3.3OUT1.1 C3.3OUT2.1 SENSOR_PSWITCH.6(OUT) SENSOR_USBA_IN.1
3.3VOUT: 19_PINOUT.9 C3.3MCU1.1 C3.3MCU.1 C3.3OUT3.2 C3.3OUT4.2 COUT1.1 COUT2.1 COUT.1 CUSB1.2 CUSB2.2 DA_CONVERTER_SD.1(VCC) L1.2 LED2.A@1(A) MCU_P_JP.2 OP_AMP_LEDS.8(VCC) RFAULT2.2 RFBT.2 RLEDOUT2.2 RLEDOUT3.2 RU2.2 SD_CONNECTOR.4(VDD) SDVC.1 SENSOR_PSWITCH.1(IN) UART_USB_CONVERTER.6(VDD) UART_USB_CONVERTER.7(VREGIN)
3.3VOUTUSB1: CVCCSERVO.1 LED4.A@1(A) SERVO_CONTROLLER.28(VDD) SERVO_REGULATOR.2(OUTPUT) SPULRSCL.1 SPULSDA.1
3.3VOUTUSB2: CVINT.1 LED5.A@1(A) RFAULT1.1 RFAULT.2 RLEDOUT4.2 RLEDOUT5.2 STEPPER_CONTROLLER.20(VINT) STEPPER_REGULATOR.2(OUTPUT)
5VINUSB1: C3.3OUT5.1 C3.3OUT6.1 CUSB3.1 D5.C(K) SERVO_PSWITCH.6(OUT)
5VINUSB21: C3.3OUT9.1 C3.3OUT10.1 CUSB5.1 D13.C(K) STEPPER_P_SWITCH.6(OUT)
5VOUT: 4PIN_I2C_TEST.1 19_PINOUT.1 C3.3OUT7.2 C3.3OUT8.2 C3.3OUT11.2 C3.3OUT12.2 COUT3.1 COUT4.1 COUT5.1 CUSB.1 D1.C(K) L2.2 LED3.A@1(A) RFAULT3.2 RFAULT4.2 RFBT1.2 RLEDOUT1.2 RLEDOUT.2 SERVO_PSWITCH.1(IN) STEPPER_P_SWITCH.1(IN)
5VOUTUSB12: CUSB4.1 D9.C(K) SERVO_PINOUT.3 SERVO_PINOUT.4 SERVO_PINOUT.9 SERVO_REGULATOR.3(INPUT) U$3.P$1(6V) U$4.P$1(6V) U$5.P$1(6V)
5VOUTUSB22: CUSB6.1 CVCP.1 CVMOT2.2 CVMOT3.2 CVMOT.2 D17.C(K) RVMOT.2 STEPPER_CONTROLLER.18(VM) STEPPER_CONTROLLER.19(VM) STEPPER_REGULATOR.3(INPUT) U19.8(VCC)
12VIN: 3.3V_REGULATOR.10(VIN_2) 3.3V_REGULATOR.21(VIN) 5V_REGULATOR.10(VIN_2) 5V_REGULATOR.21(VIN) BAT_JP.2 CIN1.1 CIN2.1 CIN3.1 CIN4.1 CIN5.1 CIN.1 CINX1.1 CINX2.1 CINX3.1 CINX4.1 CINX5.1 CINX.1 RENT1.2 RENT.2
AOUT1: U$1.BLK-A
AOUT2: U$1.GRN-C
BOUT1: U$1.RED-B
BOUT2: U$1.BLU-D
D+: D3.2(A) UART_USB_CONVERTER.4(D+) UART_USBC_IN.A6(DP1) UART_USBC_IN.B6(DP2)
D-: D4.2(A) UART_USB_CONVERTER.5(D-) UART_USBC_IN.A7(DN1) UART_USBC_IN.B7(DN2)
DTR: Q2.2(E) RU5.2 UART_USB_CONVERTER.28(DTR)
EN: CENMCU.1 CENS.1 MCU.3(EN) Q1.3(C) RENMCU.1 SW4.4
FSPICLK: 19_PINOUT.4 DA_CONVERTER_SD.3(1A) DA_CONVERTER_SD.9(4A) MCU.6(IO6)
FSPID: 19_PINOUT.5 DA_CONVERTER_SD.5(2A) MCU.7(IO7)
FSPIQ: 19_PINOUT.6 MCU.27(IO2) SD_CONNECTOR.7(DATA_OUT)
GND: 3.3V_REGULATOR.2(AGND) 3.3V_REGULATOR.6(VSNS-) 3.3V_REGULATOR.11(PGND_2) 3.3V_REGULATOR.12(PGND_3) 3.3V_REGULATOR.13(PGND_4) 3.3V_REGULATOR.14(PGND_5) 3.3V_REGULATOR.15(PGND_6) 3.3V_REGULATOR.16(PGND_7) 3.3V_REGULATOR.17(PGND_8) 3.3V_REGULATOR.18(PGND) 4PIN_I2C_TEST.4 5V_REGULATOR.2(AGND) 5V_REGULATOR.6(VSNS-) 5V_REGULATOR.11(PGND_2) 5V_REGULATOR.12(PGND_3) 5V_REGULATOR.13(PGND_4) 5V_REGULATOR.14(PGND_5) 5V_REGULATOR.15(PGND_6) 5V_REGULATOR.16(PGND_7) 5V_REGULATOR.17(PGND_8) 5V_REGULATOR.18(PGND) 19_PINOUT.19 BAT_JP.1 C3.3MCU1.2 C3.3MCU.2 C3.3OUT1.2 C3.3OUT2.2 C3.3OUT3.1 C3.3OUT4.1 C3.3OUT5.2 C3.3OUT6.2 C3.3OUT7.1 C3.3OUT8.1 C3.3OUT9.2 C3.3OUT10.2 C3.3OUT11.1 C3.3OUT12.1 CBUS.2 CENMCU.2 CENS1.2 CENS.2 CIN1.2 CIN2.2 CIN3.2 CIN4.2 CIN5.2 CIN.2 CINX1.2 CINX2.2 CINX3.2 CINX4.2 CINX5.2 CINX.2 COUT1.2 COUT2.2 COUT3.2 COUT4.2 COUT5.2 COUT.2 CSS1.1 CSS.1 CUSB1.1 CUSB2.1 CUSB3.2 CUSB4.2 CUSB5.2 CUSB6.2 CUSB.2 CVCC1.1 CVCC.1 CVCCSERVO.2 CVINT.2 CVMOT2.1 CVMOT3.1 CVMOT4.1 CVMOT.1 D2.1(K) D3.1(K) D4.1(K) D6.1(K) D7.1(K) D8.1(K) D10.1(K) D11.1(K) D12.1(K) D14.1(K) D15.1(K) D16.1(K) D18.1(K) D19.1(K) D20.1(K) DA_CONVERTER_SD.8(GND) I2C_USBC_IN.A1-B12(GND_2) I2C_USBC_IN.A12-B1(GND) I2C_USBC_OUT.A1-B12(GND_2) I2C_USBC_OUT.A12-B1(GND) MCU.1(GND_2) MCU.28(GND_3) MCU.29(GND_4) MCU.30(GND_5) MCU.31(GND_6) MCU.32(GND_7) MCU.33(GND_8) MCU.34(GND_9) MCU.35(GND_10) MCU.36(GND_11) MCU.37(GND) OP_AMP_LEDS.4(GND) PURESET.1 R1.1(A) RADECAY.2 RAISEN.2 RBDECAY.2 RBISEN.2 RENB1.1 RENB.1 RFBB1.1 RFBB.1 RILIM1.1 RILIM2.1 RILIM.1 RMODE1.1 RMODE.1 ROE.2 RS1.1 RS2.1 RS3.1 RS4.1 RS5.1 RS6.1 RS.1 RTRIP1.1 RTRIP.1 RU1.1 RU3.1 RUSB1.2 RUSB2.2 RUSB3.2 RUSB4.2 RUSB5.2 RUSB6.2 RUSB7.2 RUSB8.2 RUSB9.2 RUSB.2 SD_CONNECTOR.6(VSS) SD_CONNECTOR.MT1(GND) SD_CONNECTOR.MT2(GND1) SDVC.2 SENCDC1.2 SENCDC2.2 SENSOR1.3(GND) SENSOR2.3(GND) SENSOR3.3(GND) SENSOR4.3(GND) SENSOR5.3(GND) SENSOR_MUX.2(A1) SENSOR_MUX.3(!RESET) SENSOR_MUX.12(GND) SENSOR_MUX.21(A2) SENSOR_PSWITCH.2(GND) SENSOR_USBA_IN.4 SENSOR_USBA_OUT.4 SERVO_CONTROLLER.14(VSS) SERVO_CONTROLLER.25(EXTCLK) SERVO_PINOUT.5 SERVO_PINOUT.6 SERVO_PINOUT.11 SERVO_PSWITCH.2(GND) SERVO_REGULATOR.1(GND) STEPPER_CONTROLLER.21(GND) STEPPER_CONTROLLER.25(EXP(GND)) STEPPER_P_SWITCH.2(GND) STEPPER_REGULATOR.1(GND) STEPPER_USBC_IN.A1-B12(GND_2) STEPPER_USBC_IN.A12-B1(GND) STEPPER_USBC_OUT.A1-B12(GND_2) STEPPER_USBC_OUT.A12-B1(GND) SW3.3 SW3.4 SW4.1 SW5.1 U14.2(ANODE) U15.2(ANODE) U16.2(ANODE) U19.4(GND) U$3.P$2(GND) U$4.P$2(GND) U$5.P$2(GND) UART_USB_CONVERTER.3(GND) UART_USB_CONVERTER.29(GND) UART_USBC_IN.A1-B12(GND_2) UART_USBC_IN.A12-B1(GND)
GPIO1: MCU.9(IO1) SENSOR_PSWITCH.3(EN)
GPIO3: 19_PINOUT.18 MCU.26(IO3)
GPIO5: 19_PINOUT.10 MCU.5(IO5)
GPIO8: 19_PINOUT.11 D15.2(A) MCU.10(IO8) STEPPER_USBC_IN.A6(DP1) STEPPER_USBC_IN.B6(DP2)
GPIO8M: D19.2(A) STEPPER_CONTROLLER.11(STEP/BENBL) STEPPER_USBC_OUT.A6(DP1) STEPPER_USBC_OUT.B6(DP2)
GPIO9: 19_PINOUT.12 D16.2(A) MCU.15(IO9) STEPPER_USBC_IN.A7(DN1) STEPPER_USBC_IN.B7(DN2)
GPIO9M: D20.2(A) STEPPER_CONTROLLER.12(DIR/BPHASE) STEPPER_USBC_OUT.A7(DN1) STEPPER_USBC_OUT.B7(DN2)
GPIO12: 19_PINOUT.13 MCU.13(IO12) SERVO_PSWITCH.3(EN)
GPIO13: 19_PINOUT.14 MCU.14(IO13) STEPPER_P_SWITCH.3(EN)
GPIO15: 19_PINOUT.15 MCU.23(IO15)
GPIO19: 19_PINOUT.16 MCU.17(IO19)
GPIO20: 19_PINOUT.17 MCU.18(IO20)
IO0: CENS1.1 MCU.8(IO0) Q2.3(C) SW5.4
MCUI2CSCL: PUSCL.1 SENSOR_MUX.22(SCL) SENSOR_USBA_OUT.3
MCUI2CSDA: PUSDA.1 SENSOR_MUX.23(SDA) SENSOR_USBA_OUT.2
MCUSCL: 4PIN_I2C_TEST.2 19_PINOUT.2 D7.2(A) I2C_USBC_IN.A6(DP1) I2C_USBC_IN.B6(DP2) MCU.11(IO10) SENSOR_USBA_IN.3
MCUSDA: 4PIN_I2C_TEST.3 19_PINOUT.3 D8.2(A) I2C_USBC_IN.A7(DN1) I2C_USBC_IN.B7(DN2) MCU.12(IO11) SENSOR_USBA_IN.2
MCUSDCS: 19_PINOUT.8 DA_CONVERTER_SD.7(3A) MCU.16(IO18)
MUXSC0: PUSC0.1 SENSOR1.1(SCL) SENSOR_MUX.5(SC0)
MUXSC1: PUSC1.1 SENSOR2.1(SCL) SENSOR_MUX.7(SC1)
MUXSC2: PUSC2.1 SENSOR3.1(SCL) SENSOR_MUX.9(SC2)
MUXSC3: PUSC3.1 SENSOR4.1(SCL) SENSOR_MUX.11(SC3)
MUXSC4: PUSC4.1 SENSOR5.1(SCL) SENSOR_MUX.14(SC4)
MUXSD0: PUSD0.1 SENSOR1.4(SDA) SENSOR_MUX.4(SD0)
MUXSD1: PUSD1.1 SENSOR2.4(SDA) SENSOR_MUX.6(SD1)
MUXSD2: PUSD2.1 SENSOR3.4(SDA) SENSOR_MUX.8(SD2)
MUXSD3: PUSD3.1 SENSOR4.4(SDA) SENSOR_MUX.10(SD3)
MUXSD4: PUSD4.1 SENSOR5.4(SDA) SENSOR_MUX.13(SD4)
N$1: 3.3V_REGULATOR.1(BOOT) CBOOT.1
N$2: 3.3V_REGULATOR.20(SW) CBOOT.2 L1.1
N$3: 3.3V_REGULATOR.19(VCC) CVCC.2 RPG.1
N$4: 3.3V_REGULATOR.9(PGOOD) RPG.2
N$5: 3.3V_REGULATOR.8(EN) RENB.2 RENT.1
N$6: 3.3V_REGULATOR.4(MODE) RMODE.2
N$7: 3.3V_REGULATOR.3(TRIP) RTRIP.2
N$8: 3.3V_REGULATOR.5(SS_REFIN) CSS.2
N$9: 3.3V_REGULATOR.7(FB) RFBB.2 RFBT.1
N$10: RENMCU1.2 UART_USB_CONVERTER.26(TXD)
N$11: 5V_REGULATOR.1(BOOT) CBOOT1.1
N$12: RENMCU2.2 UART_USB_CONVERTER.25(RXD)
N$13: 5V_REGULATOR.20(SW) CBOOT1.2 L2.1
N$14: 5V_REGULATOR.19(VCC) CVCC1.2 RPG1.1
N$15: 5V_REGULATOR.9(PGOOD) RPG1.2
N$16: 5V_REGULATOR.4(MODE) RMODE1.2
N$17: 5V_REGULATOR.3(TRIP) RTRIP1.2
N$18: 5V_REGULATOR.5(SS_REFIN) CSS1.2
N$19: 5V_REGULATOR.8(EN) RENB1.2 RENT1.1
N$20: CVMOT4.2 RVMOT.1
N$21: RBISEN.1 STEPPER_CONTROLLER.8(BISEN)
N$22: 5V_REGULATOR.7(FB) RFBB1.2 RFBT1.1
N$23: RAISEN.1 STEPPER_CONTROLLER.5(AISEN)
N$24: RBDECAY.1 STEPPER_CONTROLLER.2(BDECAY)
N$25: RADECAY.1 STEPPER_CONTROLLER.3(ADECAY)
N$26: RU1.2 UART_USB_CONVERTER.11(!SUSPEND)
N$27: RFAULT.1 STEPPER_CONTROLLER.16(NFAULT)
N$28: STEPPER_CONTROLLER.4(AOUT1) STEPPER_PINOUT1.1
N$29: STEPPER_CONTROLLER.6(AOUT2) STEPPER_PINOUT1.2
N$30: STEPPER_CONTROLLER.9(BOUT1) STEPPER_PINOUT1.3
N$31: STEPPER_CONTROLLER.7(BOUT2) STEPPER_PINOUT1.4
N$32: CVCP.2 STEPPER_CONTROLLER.17(VCP)
N$33: R1.2(S) STEPPER_CONTROLLER.22(AVREF) STEPPER_CONTROLLER.23(BVREF)
N$34: SJ1.1 STEPPER_PINOUT2.4
N$35: SJ2.1 STEPPER_PINOUT2.3
N$36: SJ2.2 STEPPER_CONTROLLER.15(CONFIG)
N$37: STEPPER_CONTROLLER.14(M1) STEPPER_PINOUT2.1
N$38: STEPPER_CONTROLLER.13(M0/APHASE) STEPPER_PINOUT2.2
N$39: ROE.1 SERVO_CONTROLLER.23(~OE)
N$40: RU2.1 UART_USB_CONVERTER.9(!RST)
N$41: CBUS.1 RU3.2 RU4.1 UART_USB_CONVERTER.8(VBUS)
N$42: Q1.1(B) RU5.1
N$43: Q2.1(B) RU6.1
N$44: RS4.2 SERVO_CONTROLLER.2(A1)
N$45: RS5.2 SERVO_CONTROLLER.1(A0)
N$46: RS3.2 SERVO_CONTROLLER.3(A2)
N$47: RS2.2 SERVO_CONTROLLER.4(A3)
N$48: RS1.2 SERVO_CONTROLLER.5(A4)
N$49: RS.2 SERVO_CONTROLLER.24(A5)
N$50: LED4.C@1(C) RS6.2
N$51: LED3.C@1(C) RLEDOUT9.1
N$52: MCU.2(3V3) MCU_P_JP.1 RENMCU.2
N$53: RUSB.1 UART_USBC_IN.A5(CC1)
N$54: LED1.C@1(C) RSDCS.2
N$55: DA_CONVERTER_SD.10(4Y) LED1.A@1(A)
N$56: RUSB1.1 UART_USBC_IN.B5(CC2)
N$57: DA_CONVERTER_SD.2(1Y) SD_CONNECTOR.5(SCLK)
N$58: RILIM.2 SENSOR_PSWITCH.5(ILIM)
N$59: DA_CONVERTER_SD.4(2Y) SD_CONNECTOR.3(DATA_IN)
N$61: RFAULT2.1 SENSOR_PSWITCH.4(!FAULT)
N$62: I2C_USBC_IN.A5(CC1) RUSB2.1
N$63: I2C_USBC_IN.B5(CC2) RUSB3.1
N$64: I2C_USBC_OUT.A5(CC1) RUSB4.1
N$65: I2C_USBC_OUT.B5(CC2) RUSB5.1
N$66: RUSB6.1 STEPPER_USBC_IN.A5(CC1)
N$67: RILIM1.2 SERVO_PSWITCH.5(ILIM)
N$68: RFAULT3.1 SERVO_PSWITCH.4(!FAULT)
N$69: RUSB7.1 STEPPER_USBC_IN.B5(CC2)
N$70: RILIM2.2 STEPPER_P_SWITCH.5(ILIM)
N$71: RFAULT4.1 STEPPER_P_SWITCH.4(!FAULT)
N$72: RUSB8.1 STEPPER_USBC_OUT.A5(CC1)
N$73: RUSB9.1 STEPPER_USBC_OUT.B5(CC2)
N$74: OP_AMP_LEDS.5(2IN+) RLEDOUT2.1 U14.1(CATHODE)
N$75: OP_AMP_LEDS.6(2IN-) RLEDOUT3.1
N$76: OP_AMP_LEDS.7(2OUT) RLEDOUT8.2
N$77: OP_AMP_LEDS.3(1IN+) RLEDOUT.1 U15.1(CATHODE)
N$78: OP_AMP_LEDS.2(1IN-) RLEDOUT1.1
N$79: OP_AMP_LEDS.1(1OUT) RLEDOUT9.2
N$80: LED2.C@1(C) RLEDOUT8.1
N$81: U$2.P$1 UART_USB_CONVERTER.27(DSR)
N$82: RLEDOUT4.1 U16.1(CATHODE) U19.3(1IN+)
N$83: RLEDOUT5.1 U19.2(1IN-)
N$84: RLEDOUT10.2 U19.1(1OUT)
N$85: U$6.P$1 UART_USB_CONVERTER.1(DCD)
N$86: U$7.P$1 UART_USB_CONVERTER.23(CTS)
N$87: U19.6(2IN-) U$9.P$1
N$88: LED5.C@1(C) RLEDOUT10.1
N$89: U19.5(2IN+) U$8.P$1
N$90: STEPPER_CONTROLLER.10(NENBL/AENBL) STEPPER_PINOUT2.5
N$91: DA_CONVERTER_SD.11(5A) U$10.P$1
N$92: DA_CONVERTER_SD.14(6A) U$11.P$1
PWM1: SERVO_CONTROLLER.6(LED0) SERVO_PINOUT.1 U$3.P$3(PWD)
PWM2: SERVO_CONTROLLER.7(LED1) SERVO_PINOUT.7 U$4.P$3(PWD)
PWM3: SERVO_CONTROLLER.8(LED2) SERVO_PINOUT.2 U$5.P$3(PWD)
RTS: Q1.2(E) RU6.2 UART_USB_CONVERTER.24(RTS)
RXD0: MCU.24(RXD0) RENMCU2.1
SDCD: 19_PINOUT.7 MCU.4(IO4) SD_CONNECTOR.CD1(CARD_DETECT)
SDCS: DA_CONVERTER_SD.6(3Y) RSDCS.1 SD_CONNECTOR.2(CS)
SLP: RFAULT1.2 STEPPER_CONTROLLER.1(NSLEEP)
SRVSCLM: D11.2(A) I2C_USBC_OUT.A6(DP1) I2C_USBC_OUT.B6(DP2) SERVO_CONTROLLER.26(SCL) SPULRSCL.2
SRVSDAM: D12.2(A) I2C_USBC_OUT.A7(DN1) I2C_USBC_OUT.B7(DN2) SERVO_CONTROLLER.27(SDA) SPULSDA.2
TXD0: MCU.25(TXD0) RENMCU1.1
VBUS: D1.A D2.2(A) RU4.2 UART_USBC_IN.A4-B9(VBUS_2) UART_USBC_IN.A9-B4(VBUS)
VBUS11: D5.A D6.2(A) I2C_USBC_IN.A4-B9(VBUS_2) I2C_USBC_IN.A9-B4(VBUS)
VBUS12: D9.A D10.2(A) I2C_USBC_OUT.A4-B9(VBUS_2) I2C_USBC_OUT.A9-B4(VBUS)
VBUS21: D13.A D14.2(A) STEPPER_USBC_IN.A4-B9(VBUS_2) STEPPER_USBC_IN.A9-B4(VBUS)
VBUS22: D17.A D18.2(A) STEPPER_USBC_OUT.A4-B9(VBUS_2) STEPPER_USBC_OUT.A9-B4(VBUS)
VREF: R1.3(E) SJ1.2 STEPPER_CONTROLLER.24(VREFO)
Unconnected: DA_CONVERTER_SD.12(5Y) DA_CONVERTER_SD.15(6Y) I2C_USBC_IN.A8(SBU1) I2C_USBC_IN.B8(SBU2) I2C_USBC_OUT.A8(SBU1) I2C_USBC_OUT.B8(SBU2) MCU.19(IO21) MCU.20(IO22) MCU.21(IO23) MCU.22(NC) SD_CONNECTOR.1(DAT2) SD_CONNECTOR.8(DAT1) SD_CONNECTOR.CD2(CARD_DETECT1) SENSOR_MUX.15(SD5) SENSOR_MUX.16(SC5) SENSOR_MUX.17(SD6) SENSOR_MUX.18(SC6) SENSOR_MUX.19(SD7) SENSOR_MUX.20(SC7) SERVO_CONTROLLER.9(LED3) SERVO_CONTROLLER.10(LED4) SERVO_CONTROLLER.11(LED5) SERVO_CONTROLLER.12(LED6) SERVO_CONTROLLER.13(LED7) SERVO_CONTROLLER.15(LED8) SERVO_CONTROLLER.16(LED9) SERVO_CONTROLLER.17(LED10) SERVO_CONTROLLER.18(LED11) SERVO_CONTROLLER.19(LED12) SERVO_CONTROLLER.20(LED13) SERVO_CONTROLLER.21(LED14) SERVO_CONTROLLER.22(LED15) SERVO_PINOUT.8 SERVO_PINOUT.10 SERVO_PINOUT.12 SERVO_REGULATOR.4(VOUT) STEPPER_REGULATOR.4(VOUT) STEPPER_USBC_IN.A8(SBU1) STEPPER_USBC_IN.B8(SBU2) STEPPER_USBC_OUT.A8(SBU1) STEPPER_USBC_OUT.B8(SBU2) SW4.2 SW4.3 SW5.2 SW5.3 U19.7(2OUT) UART_USB_CONVERTER.2(RI/CLK) UART_USB_CONVERTER.10(NC) UART_USB_CONVERTER.12(SUSPEND) UART_USB_CONVERTER.13(CHREN) UART_USB_CONVERTER.14(CHR1) UART_USB_CONVERTER.15(CHR0) UART_USB_CONVERTER.16(GPIO.3/WAKEUP) UART_USB_CONVERTER.17(GPIO.2/RS485) UART_USB_CONVERTER.18(GPIO.1/RXT) UART_USB_CONVERTER.19(GPIO.0/TXT) UART_USB_CONVERTER.20(GPIO.6) UART_USB_CONVERTER.21(GPIO.5) UART_USB_CONVERTER.22(GPIO.4) UART_USBC_IN.A8(SBU1) UART_USBC_IN.B8(SBU2)

## Notes on the sheet
- Regulators | Connector and Pinout | SD Connector
- UART-USB Converter | Power Swtiches | MCU
- Stepper Motor Control | Servo Motors Control | Sensors and Mux

## Library data of the parts
3.3V_REGULATOR 5V_REGULATOR = TPS54JA20RWWR:TPS54JA20RWWR; MANUFACTURER_PART_NUMBER: TPS54JA20RWWR
4PIN_I2C_TEST = PPTC041LFBN-RC:PPTC041LFBN-RC: 4 Position Header Connector Through Hole Check availability <https://pricing.snapeda.com/parts/PPTC041LFBN-RC/Sullins%20Connector/view-part?ref=eda>; AVAILABILITY: In Stock; CHECK_PRICES: https://www.snapeda.com/parts/PPTC041LFBN-RC/Sullins+Connector+Solutions/view-part/?ref=eda; DESCRIPTION: 4 Position Header Connector 0.100 (2.54mm) Through Hole Tin; MF: Sullins Connector; MP: PPTC041LFBN-RC; PACKAGE: None; PRICE: None; PURCHASE-URL: https://www.snapeda.com/api/url_track_click_mouser/?unipart_id=285917&manufacturer=Sullins Connector&part_name=PPTC041LFBN-RC&search_term=pptc041lfbn-rc; SNAPEDA_LINK: https://www.snapeda.com/parts/PPTC041LFBN-RC/Sullins+Connector+Solutions/view-part/?ref=snap
19_PINOUT = PPTC191LFBN-RC:PPTC191LFBN-RC; COPYRIGHT: Copyright (C) 2023 Ultra Librarian. All rights reserved.; MANUFACTURER_PART_NUMBER: PPTC191LFBN-RC; MFR_NAME: Sullins; TYPE: Headers, Receptacles, Female Sockets
BAT_JP = Terminal_Block2P:282837-2: TERM BLOCK 5.08MM 2POS SIDE ENTY Check availability <https://pricing.snapeda.com/parts/282837-2/TE%20Connectivity/view-part?ref=eda>; AVAILABILITY: In Stock; CHECK_PRICES: https://www.snapeda.com/parts/282837-2/TE+Connectivity+AMP+Connectors/view-part/?ref=eda; COMMENT: 282837-2; DESCRIPTION: Connector Terminal Blocks Receptacle 2 Position 5.08mm Solder Straight Thru-Hole 13.5A/Contact; MF: TE Connectivity; MP: 282837-2; PACKAGE: None; PRICE: None; PURCHASE-URL: https://pricing.snapeda.com/search?q=282837-2&ref=eda; SNAPEDA_LINK: https://www.snapeda.com/parts/282837-2/TE+Connectivity+AMP+Connectors/view-part/?ref=snap
C3.3MCU C3.3MCU1 C3.3OUT1-C3.3OUT12 CBOOT CBOOT1 CBUS CENMCU CENS CENS1 CIN CIN1-CIN5 CINX CINX1-CINX5 COUT COUT1-COUT5 CSS CSS1 CUSB CUSB1-CUSB6 CVCC CVCC1 CVCCSERVO CVCP CVINT CVMOT CVMOT2-CVMOT4 SDVC SENCDC1 SENCDC2 = rcl:C-EU: CAPACITOR, European symbol; SPICEPREFIX: C
D1 D5 D9 D13 D17 = 1N5819HW-7-F:1N5819HW-7-F: 1N5819HW Series 40 V 1 A Surface Mount Schottky Barrier Rectifier - SOD-123 Check availability <https://pricing.snapeda.com/parts/1N5819HW-7-F/Diodes%20Inc./view-part?ref=eda>; AVAILABILITY: In Stock; CHECK_PRICES: https://www.snapeda.com/parts/1N5819HW-7-F/Diodes+Inc./view-part/?ref=eda; DESCRIPTION: Diode Schottky 1A 40V SOD123 | Diodes Inc 1N5819HW-7-F; MF: Diodes Inc.; MP: 1N5819HW-7-F; PACKAGE: SOD-123 Fairchild Semiconductor; PRICE: None; PURCHASE-URL: https://www.snapeda.com/api/url_track_click_mouser/?unipart_id=42272&manufacturer=Diodes Inc.&part_name=1N5819HW-7-F&search_term=1n5819hw-7-f; SNAPEDA_LINK: https://www.snapeda.com/parts/1N5819HW-7-F/Diodes+Inc./view-part/?ref=snap
D2-D4 D6-D8 D10-D12 D14-D16 D18-D20 = CPDQ5V0-HF:CPDQ5V0-HF: ESD Suppressors / TVS Diodes SMD ESD Diode 5V Bi-Direction Source: Datasheet <https://componentsearchengine.com/Datasheets/1/CPDQ5V0-HF.pdf> Check availability <https://pricing.snapeda.com/parts/CPDQ5V0-HF/Comchip%20Technology/view-part?ref=eda>; AVAILABILITY: In Stock; CHECK_PRICES: https://www.snapeda.com/parts/CPDQ5V0-HF/Comchip+Technology/view-part/?ref=eda; DESCRIPTION: 18.6V Clamp 9.4A (8/20µs) Ipp Tvs Diode Surface Mount 0402/SOD-923F; MF: Comchip Technology; MP: CPDQ5V0-HF; PACKAGE: 0402 Comchip; PRICE: None; PURCHASE-URL: https://www.snapeda.com/api/url_track_click_mouser/?unipart_id=809934&manufacturer=Comchip Technology&part_name=CPDQ5V0-HF&search_term=cpdq5v0-hf; SNAPEDA_LINK: https://www.snapeda.com/parts/CPDQ5V0-HF/Comchip+Technology/view-part/?ref=snap
DA_CONVERTER_SD = CD74HC4050MT:CD74HC4050MT: Check availability <https://pricing.snapeda.com/parts/CD74HC4050MT/Texas%20Instruments/view-part?ref=eda>; AVAILABILITY: In Stock; CHECK_PRICES: https://www.snapeda.com/parts/CD74HC4050MT/Texas+Instruments/view-part/?ref=eda; DESCRIPTION: 6-ch, 2-V to 6-V buffers; MF: Texas Instruments; MP: CD74HC4050MT; PACKAGE: SOIC-16 Texas Instruments; PRICE: None; PURCHASE-URL: https://www.snapeda.com/api/url_track_click_mouser/?unipart_id=1170164&manufacturer=Texas Instruments&part_name=CD74HC4050MT&search_term=cd74hc4050; SNAPEDA_LINK: https://www.snapeda.com/parts/CD74HC4050MT/Texas+Instruments/view-part/?ref=snap
I2C_USBC_IN I2C_USBC_OUT STEPPER_USBC_IN STEPPER_USBC_OUT UART_USBC_IN = USB4110-GF-A:USB4110-GF-A; COPYRIGHT: Copyright (C) 2023 Ultra Librarian. All rights reserved.; MANUFACTURER_PART_NUMBER: USB4110-GF-A; MFR_NAME: Global Connector Technology
L1 L2 = rcl:L-US: INDUCTOR, American symbol; SPICEPREFIX: L
LED1-LED5 = adafruit:LED: LED OSRAM: - CHIPLED LG R971, LG N971, LY N971, LG Q971, LY Q971, LO R971, LY R971 LH N974, LH R974 LS Q976, LO Q976, LY Q976 LO Q996 - Hyper CHIPLED LW Q18S LB Q993, LB Q99A, LB R99A - SideLED LS A670, LO A670, LY A670, LG A670, LP A670 LB A673, LV A673, LT A673, LW A673 LH A674 LY A675 LS A676, LA A676, LO A676, LY A676, LW A676 LS A679, LY A679, LG A679 - Hyper Micro SIDELED® LS Y876, LA Y876, LO Y876, LY Y876 LT Y87S - SmartLED LW L88C, LW L88S LB L89C, LB L89S, LG L890 LS L89K, LO L89K, LY L89K LS L896, LA L896, LO L896, LY L896 - TOPLED LS T670, LO T670, LY T670, LG T670, LP T670 LSG T670, LSP T670, LSY T670, LOP T670, LYG T670 LG T671, LOG T671, LSG T671 LB T673, LV T673, LT T673, LW T673 LH T674 LS T676, LA T676, LO T676, LY T676, LB T676, LH T676, LSB T676, LW T676 LB T67C, LV T67C, LT T67C, LS T67K, LO T67K, LY T67K, LW E67C LS E67B, LA E67B, LO E67B, LY E67B, LB E67C, LV E67C, LT E67C LW T67C LS T679, LY T679, LG T679 LS T770, LO T770, LY T770, LG T770, LP T770 LB T773, LV T773, LT T773, LW T773 LH T774 LS E675, LA E675, LY E675, LS T675 LS T776, LA T776, LO T776, LY T776, LB T776 LHGB T686 LT T68C, LB T68C - Hyper Mini TOPLED® LB M676 - Mini TOPLED Santana® LG M470 LS M47K, LO M47K, LY M47K Source: http://www.osram.convergy.de/
MCU = ESP32-C6-WROOM-1U:ESP32-C6-WROOM-1-N8; COPYRIGHT: Copyright (C) 2023 Ultra Librarian. All rights reserved.; MANUFACTURER_PART_NUMBER: ESP32-C6-WROOM-1-N8; MFR_NAME: Espressif Systems; TYPE: RF
MCU_P_JP = jumper:JP1Q: JUMPER
OP_AMP_LEDS U19 = LM358DR:LM358DR: Check availability <https://pricing.snapeda.com/parts/LM358DR/Texas%20Instruments/view-part?ref=eda>; AVAILABILITY: In Stock; CHECK_PRICES: https://www.snapeda.com/parts/LM358DR/Texas+Instruments/view-part/?ref=eda; DESCRIPTION: Dual, 30-V, 700-kHz operational amplifier; MF: Texas Instruments; MP: LM358DR; PACKAGE: SOIC-8 Texas Instruments; PRICE: None; PURCHASE-URL: https://www.snapeda.com/api/url_track_click_mouser/?unipart_id=6639&manufacturer=Texas Instruments&part_name=LM358DR&search_term=lm358dr; SNAPEDA_LINK: https://www.snapeda.com/parts/LM358DR/Texas+Instruments/view-part/?ref=snap
PURESET PUSC0 PUSC1-PUSC4 PUSCL PUSD0 PUSD1-PUSD4 PUSDA RADECAY RAISEN RBDECAY RBISEN RENB RENB1 RENMCU RENMCU1 RENMCU2 RENT RENT1 RFAULT RFAULT1-RFAULT4 RFBB RFBB1 RFBT RFBT1 RILIM RILIM1 RILIM2 RLEDOUT RLEDOUT1-RLEDOUT5 RLEDOUT8-RLEDOUT10 RMODE RMODE1 ROE RPG RPG1 RS RS1-RS6 RSDCS RTRIP RTRIP1 RU1-RU6 RUSB RUSB1-RUSB9 RVMOT SPULRSCL SPULSDA = rcl:R-US_: RESISTOR, American symbol; SPICEPREFIX: R
Q1 Q2 = SS8050-G:SS8050-G: Bipolar (BJT) Transistor NPN 25 V 1.5 A 100MHz 300 mW Surface Mount SOT-23-3 Check availability <https://pricing.snapeda.com/parts/SS8050-G/Comchip%20Technology/view-part?ref=eda>; AVAILABILITY: In Stock; CHECK_PRICES: https://www.snapeda.com/parts/SS8050-G/Comchip+Technology/view-part/?ref=eda; DESCRIPTION: Bipolar (BJT) Transistor NPN 25 V 1.5 A 100MHz 300 mW Surface Mount SOT-23-3; MF: Comchip Technology; MP: SS8050-G; PACKAGE: TO-236 Comchip; PRICE: None; PURCHASE-URL: https://www.snapeda.com/api/url_track_click_mouser/?unipart_id=809142&manufacturer=Comchip Technology&part_name=SS8050-G&search_term=ss8050-g; SNAPEDA_LINK: https://www.snapeda.com/parts/SS8050-G/Comchip+Technology/view-part/?ref=snap
R1 = pot:TRIM_US-: POTENTIOMETER
SD_CONNECTOR = adafruit:MICROSD: Micro-SD / Transflash card holder with SPI pinout For the 3M # 2908-05WB-MG and/or 4UCON #19656 push-push type
SENSOR1-SENSOR5 = VEML7700-TT:VEML7700-TT: Check availability <https://pricing.snapeda.com/parts/VEML7700-TT/Vishay%20Semiconductor/view-part?ref=eda>; AVAILABILITY: In Stock; CHECK_PRICES: https://www.snapeda.com/parts/VEML7700-TT/Vishay+Semiconductor+Opto+Division/view-part/?ref=eda; DESCRIPTION: Optical Sensor Ambient - I²C 4-SMD, J-Lead; MF: Vishay Semiconductor; MP: VEML7700-TT; PACKAGE: SMD-4 Vishay Semiconductor; PRICE: None; PURCHASE-URL: https://www.snapeda.com/api/url_track_click_mouser/?unipart_id=534245&manufacturer=Vishay Semiconductor&part_name=VEML7700-TT&search_term=veml7700; SNAPEDA_LINK: https://www.snapeda.com/parts/VEML7700-TT/Vishay+Semiconductor+Opto+Division/view-part/?ref=snap
SENSOR_MUX = TCA9548APWR:TCA9548APWR: Check availability <https://pricing.snapeda.com/parts/TCA9548APWR/Texas%20Instruments/view-part?ref=eda>; AVAILABILITY: In Stock; CHECK_PRICES: https://www.snapeda.com/parts/TCA9548APWR/Texas+Instruments/view-part/?ref=eda; DESCRIPTION: 8-channel 1.65- to 5.5-V I2C/SMBus switch with reset & voltage translation; MF: Texas Instruments; MP: TCA9548APWR; PACKAGE: TSSOP-24 Texas Instruments; PRICE: None; PURCHASE-URL: https://www.snapeda.com/api/url_track_click_mouser/?unipart_id=280817&manufacturer=Texas Instruments&part_name=TCA9548APWR&search_term=tca9548a; SNAPEDA_LINK: https://www.snapeda.com/parts/TCA9548APWR/Texas+Instruments/view-part/?ref=snap
SENSOR_PSWITCH SERVO_PSWITCH STEPPER_P_SWITCH = AP22653W6-7:AP22653W6-7: Power Switch/Driver 1:1 P-Channel 2.1A SOT-23-6 Check availability <https://pricing.snapeda.com/parts/AP22653W6-7/Diodes%20Incorporated/view-part?ref=eda>; AVAILABILITY: In Stock; CHECK_PRICES: https://www.snapeda.com/parts/AP22653W6-7/Diodes+Inc./view-part/?ref=eda; DESCRIPTION: Power Switch/Driver 1:1 P-Channel 2.1A SOT-23-6; MF: Diodes Incorporated; MP: AP22653W6-7; PACKAGE: SOT-23-6 Diodes Incorporated; PRICE: None; PURCHASE-URL: https://www.snapeda.com/api/url_track_click_mouser/?unipart_id=4792807&manufacturer=Diodes Incorporated&part_name=AP22653W6-7&search_term=ap22653w6-7; SNAPEDA_LINK: https://www.snapeda.com/parts/AP22653W6-7/Diodes+Inc./view-part/?ref=snap
SENSOR_USBA_IN SENSOR_USBA_OUT = USB-AP-S-RA-SMT:USB-AP-S-RA-SMT; COPYRIGHT: Copyright (C) 2023 Ultra Librarian. All rights reserved.; MANUFACTURER_PART_NUMBER: USB-AP-S-RA-SMT; MFR_NAME: ADAM TECHNOLOGIES INC
SERVO_CONTROLLER = PCA9685PW_112:PCA9685PW,112: 16-channel, 12-bit PWM Fm+ I2C-bus LED controller Check availability <https://pricing.snapeda.com/parts/PCA9685PW%2C112/NXP%20USA/view-part?ref=eda>; AVAILABILITY: In Stock; CHECK_PRICES: https://www.snapeda.com/parts/PCA9685PW,112/NXP+USA+Inc./view-part/?ref=eda; DESCRIPTION: LED Driver IC 16 Output Linear - PWM Dimming 25mA 28-TSSOP; MF: NXP USA; MP: PCA9685PW,112; PACKAGE: TSSOP-28 NXP Semiconductors; PRICE: None; PURCHASE-URL: https://pricing.snapeda.com/search?q=PCA9685PW,112&ref=eda; SNAPEDA_LINK: https://www.snapeda.com/parts/PCA9685PW,112/NXP+USA+Inc./view-part/?ref=snap
SERVO_PINOUT = jumper:JP6Q: JUMPER
SERVO_REGULATOR STEPPER_REGULATOR = AZ1117IH-3.3TRG1:AZ1117IH-3.3TRG1: Check availability <https://pricing.snapeda.com/parts/AZ1117IH-3.3TRG1/Diodes%20Inc./view-part?ref=eda>; AVAILABILITY: In Stock; CHECK_PRICES: https://www.snapeda.com/parts/AZ1117IH-3.3TRG1/Diodes+Inc./view-part/?ref=eda; DESCRIPTION: Linear Voltage Regulator IC Positive Fixed 1 Output 1A SOT-223-3; MF: Diodes Inc.; MP: AZ1117IH-3.3TRG1; PACKAGE: SOT-223 Diodes Inc.; PRICE: None; PURCHASE-URL: https://www.snapeda.com/api/url_track_click_mouser/?unipart_id=490259&manufacturer=Diodes Inc.&part_name=AZ1117IH-3.3TRG1&search_term=az1117ih-3.3trg1; SNAPEDA_LINK: https://www.snapeda.com/parts/AZ1117IH-3.3TRG1/Diodes+Inc./view-part/?ref=snap
SJ1 SJ2 = jumper:SJ: SMD solder JUMPER
STEPPER_CONTROLLER = DRV8834PWP:DRV8834PWP: 2.2A Low Voltage Stepper w/ 32-step Indexer or Dual Brushed DC Motor Driver (Indexer or PH/EN Ctrl) 24-HTSSOP -40 to 85 Check availability <https://pricing.snapeda.com/parts/DRV8834PWP/Texas%20Instruments/view-part?ref=eda>; AVAILABILITY: In Stock; DESCRIPTION: 11-V, 1.5-A, dual H-bridge or stepper motor driver with 1/32 microstep indexer; MF: Texas Instruments; MP: DRV8834PWP; PACKAGE: HTSSOP-24 Texas Instruments; PRICE: None; PURCHASE-URL: https://pricing.snapeda.com/search?q=DRV8834PWP&ref=eda
STEPPER_PINOUT1 = con-lstb:MA04-1: PIN HEADER; OC_FARNELL: unknown; OC_NEWARK: unknown
STEPPER_PINOUT2 = con-lstb:MA05-1: PIN HEADER; OC_FARNELL: unknown; OC_NEWARK: unknown
SW3-SW5 = 1825910-6:1825910-6: Switch Tactile OFF (ON) SPST Round Button PC Pins 0.05A 24VDC 100000Cycles 1.57N Thru-Hole Loose Check availability <https://pricing.snapeda.com/parts/1825910-6/TE%20Connectivity/view-part?ref=eda>; AVAILABILITY: In Stock; CHECK_PRICES: https://www.snapeda.com/parts/1825910-6/TE+Connectivity+ALCOSWITCH+Switches/view-part/?ref=eda; COMMENT: 1825910-6; DESCRIPTION: Switch Push Button OFF (ON) SPST Round Button 0.05A 24VDC Momentary Contact PC Pins Thru-Hole; MF: TE Connectivity; MP: 1825910-6; PACKAGE: None; PRICE: None; PURCHASE-URL: https://www.snapeda.com/api/url_track_click_mouser/?unipart_id=226996&manufacturer=TE Connectivity&part_name=1825910-6&search_term=1825910-6; SNAPEDA_LINK: https://www.snapeda.com/parts/1825910-6/TE+Connectivity+ALCOSWITCH+Switches/view-part/?ref=snap
U14 U16 = MMSZ5225BT1G:MMSZ5225BT1G; COPYRIGHT: Copyright (C) 2023 Ultra Librarian. All rights reserved.; MANUFACTURER_PART_NUMBER: MMSZ5225BT1G; MFR_NAME: onsemi
U15 = MMSZ5230BT1G:MMSZ5230BT1G; COPYRIGHT: Copyright (C) 2023 Ultra Librarian. All rights reserved.; MANUFACTURER_PART_NUMBER: MMSZ5230BT1G; MFR_NAME: onsemi
U$1 = Motors:NEMA23
U$2 U$6-U$11 = NC_MARKER:NC_MARKER
U$3-U$5 = Motors:SERVO
UART_USB_CONVERTER = CP2102N-A02-GQFN28:CP2102N-A02-GQFN28: Check availability <https://pricing.snapeda.com/parts/CP2102N-A02-GQFN28/Silicon%20Labs/view-part?ref=eda>; AVAILABILITY: In Stock; CHECK_PRICES: https://www.snapeda.com/parts/CP2102N-A02-GQFN28/Silicon+Labs/view-part/?ref=eda; DESCRIPTION: USB Bridge, USB to UART USB 2.0 UART Interface 28-QFN (5x5); MF: Silicon Labs; MP: CP2102N-A02-GQFN28; PACKAGE: WFQFN-28 Silicon Labs; PRICE: None; PURCHASE-URL: https://www.snapeda.com/api/url_track_click_mouser/?unipart_id=4872321&manufacturer=Silicon Labs&part_name=CP2102N-A02-GQFN28&search_term=cp2102n-a02-gqfn28; SNAPEDA_LINK: https://www.snapeda.com/parts/CP2102N-A02-GQFN28/Silicon+Labs/view-part/?ref=snap